# Altium project Assem_Stn_2_Rev1.PrjPcb (part 2 of 3)

## Sheet Thermistor_ADC.SchDoc
size OrCAD B; SheetNumber: 7; SheetTotal: 11
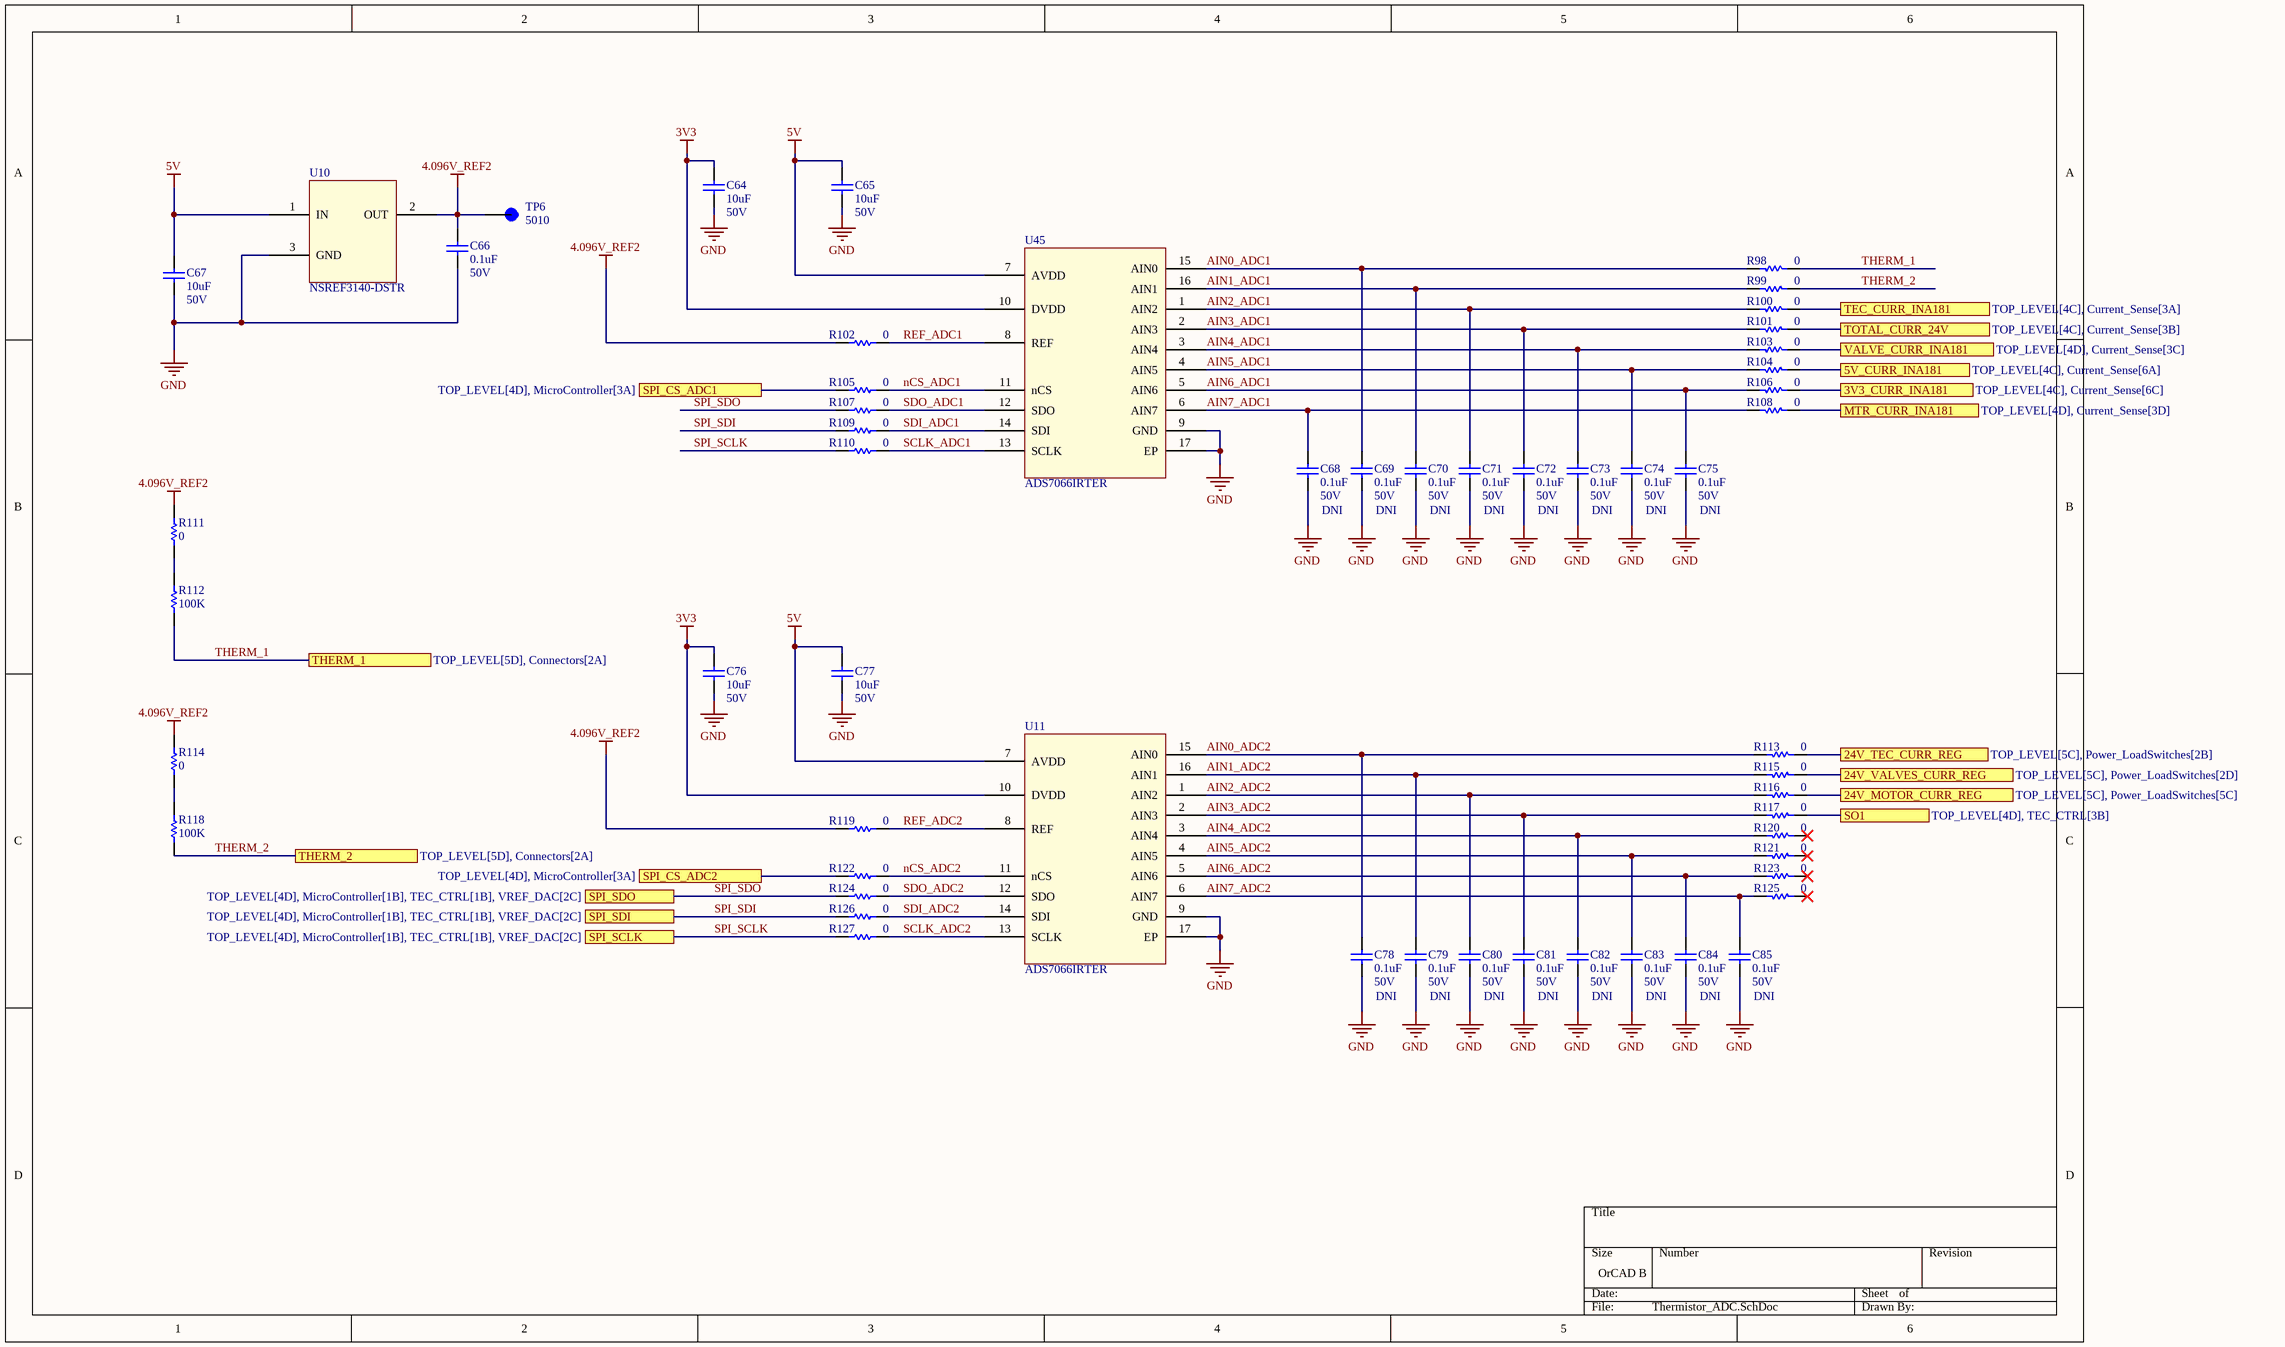
[diagram p5: Thermistor_ADC.SchDoc]

### Parts
C64  value 10uF  Rating: 50V  [DEFAULT_CAPACITOR_0805]  (hidden comment: GRM21BR61H106KE43L)
C65  value 10uF  Rating: 50V  [DEFAULT_CAPACITOR_0805]  (hidden comment: GRM21BR61H106KE43L)
C66  value 0.1uF  Rating: 50V  [DEFAULT_CAPACITOR_0805]  (hidden comment: KGM21NR71H104KT)
C67  value 10uF  Rating: 50V  [DEFAULT_CAPACITOR_0805]  (hidden comment: GRM21BR61H106KE43L)
C68  DNI  value 0.1uF  Rating: 50V  [DEFAULT_CAPACITOR_0805]
C69  DNI  value 0.1uF  Rating: 50V  [DEFAULT_CAPACITOR_0805]
C70  DNI  value 0.1uF  Rating: 50V  [DEFAULT_CAPACITOR_0805]
C71  DNI  value 0.1uF  Rating: 50V  [DEFAULT_CAPACITOR_0805]
C72  DNI  value 0.1uF  Rating: 50V  [DEFAULT_CAPACITOR_0805]
C73  DNI  value 0.1uF  Rating: 50V  [DEFAULT_CAPACITOR_0805]
C74  DNI  value 0.1uF  Rating: 50V  [DEFAULT_CAPACITOR_0805]
C75  DNI  value 0.1uF  Rating: 50V  [DEFAULT_CAPACITOR_0805]
C76  value 10uF  Rating: 50V  [DEFAULT_CAPACITOR_0805]  (hidden comment: GRM21BR61H106KE43L)
C77  value 10uF  Rating: 50V  [DEFAULT_CAPACITOR_0805]  (hidden comment: GRM21BR61H106KE43L)
C78  DNI  value 0.1uF  Rating: 50V  [DEFAULT_CAPACITOR_0805]
C79  DNI  value 0.1uF  Rating: 50V  [DEFAULT_CAPACITOR_0805]
C80  DNI  value 0.1uF  Rating: 50V  [DEFAULT_CAPACITOR_0805]
C81  DNI  value 0.1uF  Rating: 50V  [DEFAULT_CAPACITOR_0805]
C82  DNI  value 0.1uF  Rating: 50V  [DEFAULT_CAPACITOR_0805]
C83  DNI  value 0.1uF  Rating: 50V  [DEFAULT_CAPACITOR_0805]
C84  DNI  value 0.1uF  Rating: 50V  [DEFAULT_CAPACITOR_0805]
C85  DNI  value 0.1uF  Rating: 50V  [DEFAULT_CAPACITOR_0805]
R98  value 0  [DEFAULT_RESISTOR_0805]  (hidden comment: RC0805JR-070RL)
R99  value 0  [DEFAULT_RESISTOR_0805]  (hidden comment: RC0805JR-070RL)
R100  value 0  [DEFAULT_RESISTOR_0805]  (hidden comment: RC0805JR-070RL)
R101  value 0  [DEFAULT_RESISTOR_0805]  (hidden comment: RC0805JR-070RL)
R102  value 0  [DEFAULT_RESISTOR_0805]  (hidden comment: RC0805JR-070RL)
R103  value 0  [DEFAULT_RESISTOR_0805]  (hidden comment: RC0805JR-070RL)
R104  value 0  [DEFAULT_RESISTOR_0805]  (hidden comment: RC0805JR-070RL)
R105  value 0  [DEFAULT_RESISTOR_0805]  (hidden comment: RC0805JR-070RL)
R106  value 0  [DEFAULT_RESISTOR_0805]  (hidden comment: RC0805JR-070RL)
R107  value 0  [DEFAULT_RESISTOR_0805]  (hidden comment: RC0805JR-070RL)
R108  value 0  [DEFAULT_RESISTOR_0805]  (hidden comment: RC0805JR-070RL)
R109  value 0  [DEFAULT_RESISTOR_0805]  (hidden comment: RC0805JR-070RL)
R110  value 0  [DEFAULT_RESISTOR_0805]  (hidden comment: RC0805JR-070RL)
R111  value 0  [DEFAULT_RESISTOR_0805]  (hidden comment: RC0805JR-070RL)
R112  value 100K  [DEFAULT_RESISTOR_0805]  (hidden comment: RG2012P-104-B-T5)
R113  value 0  [DEFAULT_RESISTOR_0805]  (hidden comment: RC0805JR-070RL)
R114  value 0  [DEFAULT_RESISTOR_0805]  (hidden comment: RC0805JR-070RL)
R115  value 0  [DEFAULT_RESISTOR_0805]  (hidden comment: RC0805JR-070RL)
R116  value 0  [DEFAULT_RESISTOR_0805]  (hidden comment: RC0805JR-070RL)
R117  value 0  [DEFAULT_RESISTOR_0805]  (hidden comment: RC0805JR-070RL)
R118  value 100K  [DEFAULT_RESISTOR_0805]  (hidden comment: RG2012P-104-B-T5)
R119  value 0  [DEFAULT_RESISTOR_0805]  (hidden comment: RC0805JR-070RL)
R120  value 0  [DEFAULT_RESISTOR_0805]  (hidden comment: RC0805JR-070RL)
R121  value 0  [DEFAULT_RESISTOR_0805]  (hidden comment: RC0805JR-070RL)
R122  value 0  [DEFAULT_RESISTOR_0805]  (hidden comment: RC0805JR-070RL)
R123  value 0  [DEFAULT_RESISTOR_0805]  (hidden comment: RC0805JR-070RL)
R124  value 0  [DEFAULT_RESISTOR_0805]  (hidden comment: RC0805JR-070RL)
R125  value 0  [DEFAULT_RESISTOR_0805]  (hidden comment: RC0805JR-070RL)
R126  value 0  [DEFAULT_RESISTOR_0805]  (hidden comment: RC0805JR-070RL)
R127  value 0  [DEFAULT_RESISTOR_0805]  (hidden comment: RC0805JR-070RL)
TP6  5010  [TP_5011]
U10  NSREF3140-DSTR  [NSREF3140DSTR-SOT23-3L]
U11  ADS7066IRTER  [ADS7066IRTER-WQFN16]
U45  ADS7066IRTER  [ADS7066IRTER-WQFN16]

### Ports
3V3_CURR_INA181 (see TOP_LEVEL[4C], Current_Sense[6C]), 5V_CURR_INA181 (see TOP_LEVEL[4C], Current_Sense[6A]), 24V_MOTOR_CURR_REG (see TOP_LEVEL[5C], Power_LoadSwitches[5C]), 24V_TEC_CURR_REG (see TOP_LEVEL[5C], Power_LoadSwitches[2B]), 24V_VALVES_CURR_REG (see TOP_LEVEL[5C], Power_LoadSwitches[2D]), MTR_CURR_INA181 (see TOP_LEVEL[4D], Current_Sense[3D]), SO1 (see TOP_LEVEL[4D], TEC_CTRL[3B]), SPI_CS_ADC1 (see TOP_LEVEL[4D], MicroController[3A]), SPI_CS_ADC2 (see TOP_LEVEL[4D], MicroController[3A]), SPI_SCLK (see TOP_LEVEL[4D], MicroController[1B], TEC_CTRL[1B], VREF_DAC[2C]), SPI_SDI (see TOP_LEVEL[4D], MicroController[1B], TEC_CTRL[1B], VREF_DAC[2C]), SPI_SDO (see TOP_LEVEL[4D], MicroController[1B], TEC_CTRL[1B], VREF_DAC[2C]), TEC_CURR_INA181 (see TOP_LEVEL[4C], Current_Sense[3A]), THERM_1 (see TOP_LEVEL[5D], Connectors[2A]), THERM_2 (see TOP_LEVEL[5D], Connectors[2A]), TOTAL_CURR_24V (see TOP_LEVEL[4C], Current_Sense[3B]), VALVE_CURR_INA181 (see TOP_LEVEL[4D], Current_Sense[3C])

### Nets
3V3: C64.2 C76.2 U11.10(DVDD) U45.10(DVDD)
4.096V_REF2: C66.2 R102.2 R111.1 R114.1 R119.2 TP6.TP U10.2(OUT)
5V: C65.2 C67.2 C77.2 U10.1(IN) U11.7(AVDD) U45.7(AVDD)
GND: C64.1 C65.1 C66.1 C67.1 C68.1 C69.1 C70.1 C71.1 C72.1 C73.1 C74.1 C75.1 C76.1 C77.1 C78.1 C79.1 C80.1 C81.1 C82.1 C83.1 C84.1 C85.1 U10.3(GND) U11.9(GND) U11.17(EP) U45.9(GND) U45.17(EP)
3V3_CURR_INA181: R106.2 ; port 3V3_CURR_INA181
5V_CURR_INA181: R104.2 ; port 5V_CURR_INA181
24V_MOTOR_CURR_REG: R116.2 ; port 24V_MOTOR_CURR_REG
24V_TEC_CURR_REG: R113.2 ; port 24V_TEC_CURR_REG
24V_VALVES_CURR_REG: R115.2 ; port 24V_VALVES_CURR_REG
AIN0_ADC1: C69.2 R98.1 U45.15(AIN0)
AIN0_ADC2: C78.2 R113.1 U11.15(AIN0)
AIN1_ADC1: C70.2 R99.1 U45.16(AIN1)
AIN1_ADC2: C79.2 R115.1 U11.16(AIN1)
AIN2_ADC1: C71.2 R100.1 U45.1(AIN2)
AIN2_ADC2: C80.2 R116.1 U11.1(AIN2)
AIN3_ADC1: C72.2 R101.1 U45.2(AIN3)
AIN3_ADC2: C81.2 R117.1 U11.2(AIN3)
AIN4_ADC1: C73.2 R103.1 U45.3(AIN4)
AIN4_ADC2: C82.2 R120.1 U11.3(AIN4)
AIN5_ADC1: C74.2 R104.1 U45.4(AIN5)
AIN5_ADC2: C83.2 R121.1 U11.4(AIN5)
AIN6_ADC1: C75.2 R106.1 U45.5(AIN6)
AIN6_ADC2: C84.2 R123.1 U11.5(AIN6)
AIN7_ADC1: C68.2 R108.1 U45.6(AIN7)
AIN7_ADC2: C85.2 R125.1 U11.6(AIN7)
MTR_CURR_INA181: R108.2 ; port MTR_CURR_INA181
nCS_ADC1: R105.1 U45.11(nCS)
nCS_ADC2: R122.1 U11.11(nCS)
REF_ADC1: R102.1 U45.8(REF)
REF_ADC2: R119.1 U11.8(REF)
SCLK_ADC1: R110.1 U45.13(SCLK)
SCLK_ADC2: R127.1 U11.13(SCLK)
SDI_ADC1: R109.1 U45.14(SDI)
SDI_ADC2: R126.1 U11.14(SDI)
SDO_ADC1: R107.1 U45.12(SDO)
SDO_ADC2: R124.1 U11.12(SDO)
SO1: R117.2 ; port SO1
SPI_CS_ADC1: R105.2 ; port SPI_CS_ADC1
SPI_CS_ADC2: R122.2 ; port SPI_CS_ADC2
SPI_SCLK: R110.2 R127.2 ; port SPI_SCLK
SPI_SDI: R109.2 R126.2 ; port SPI_SDI
SPI_SDO: R107.2 R124.2 ; port SPI_SDO
TEC_CURR_INA181: R100.2 ; port TEC_CURR_INA181
THERM_1: R98.2 R112.2 ; port THERM_1
THERM_2: R99.2 R118.2 ; port THERM_2
TOTAL_CURR_24V: R101.2 ; port TOTAL_CURR_24V
VALVE_CURR_INA181: R103.2 ; port VALVE_CURR_INA181
NetR111_2: R111.2 R112.1
NetR114_2: R114.2 R118.1

Not connected (* = marked no-connect by the designer): R120 2*; R121 2*; R123 2*; R125 2*

### Library data of the parts
C64 C65 C67 C76 C77 = GRM21BR61H106KE43L: CAP CER 10UF 50V X5R 0805; MFR PN: GRM21BR61H106KE43L
C66 C68-C75 C78-C85 = KGM21NR71H104KT: as C2 on sheet Motor and Encoder; MFR PN: KGM21NR71H104KT
R98-R111 R113-R117 R119-R127 = RC0805JR-070RL: RES 0 OHM JUMPER 1/8W 0805; Power: 1/8W; MFR PN: RC0805JR-070RL; Tolerance: *
R112 R118 = RG2012P-104-B-T5: RES SMD 100K OHM 0.1% 1/8W 0805; Power: 1/8W; MFR PN: RG2012P-104-B-T5; Tolerance: 0.1%
TP6 = 5010: PC TEST POINT MULTIPURPOSE RED; MFR PN: 5010
U10 = NSREF3140-DSTR: 0.2% ACCURACY 15PPM 4V REF; Manufacturer: NOVOSENSE; Manufacturer P/N: NSREF3140-DSTR; MFR PN: NSREF3140-DSTR
U11 U45 = ADS7066IRTER: 16 Bit Analog to Digital Converter 8 Input 1 SAR 16-WQFN (3x3); Manufacturer: Texas Instruments; Manufacturer P/N: ADS7066IRTER; MFR PN: ADS7066IRTER

## Sheet VREF_DAC.SchDoc
size OrCAD B; SheetNumber: 8; SheetTotal: 11
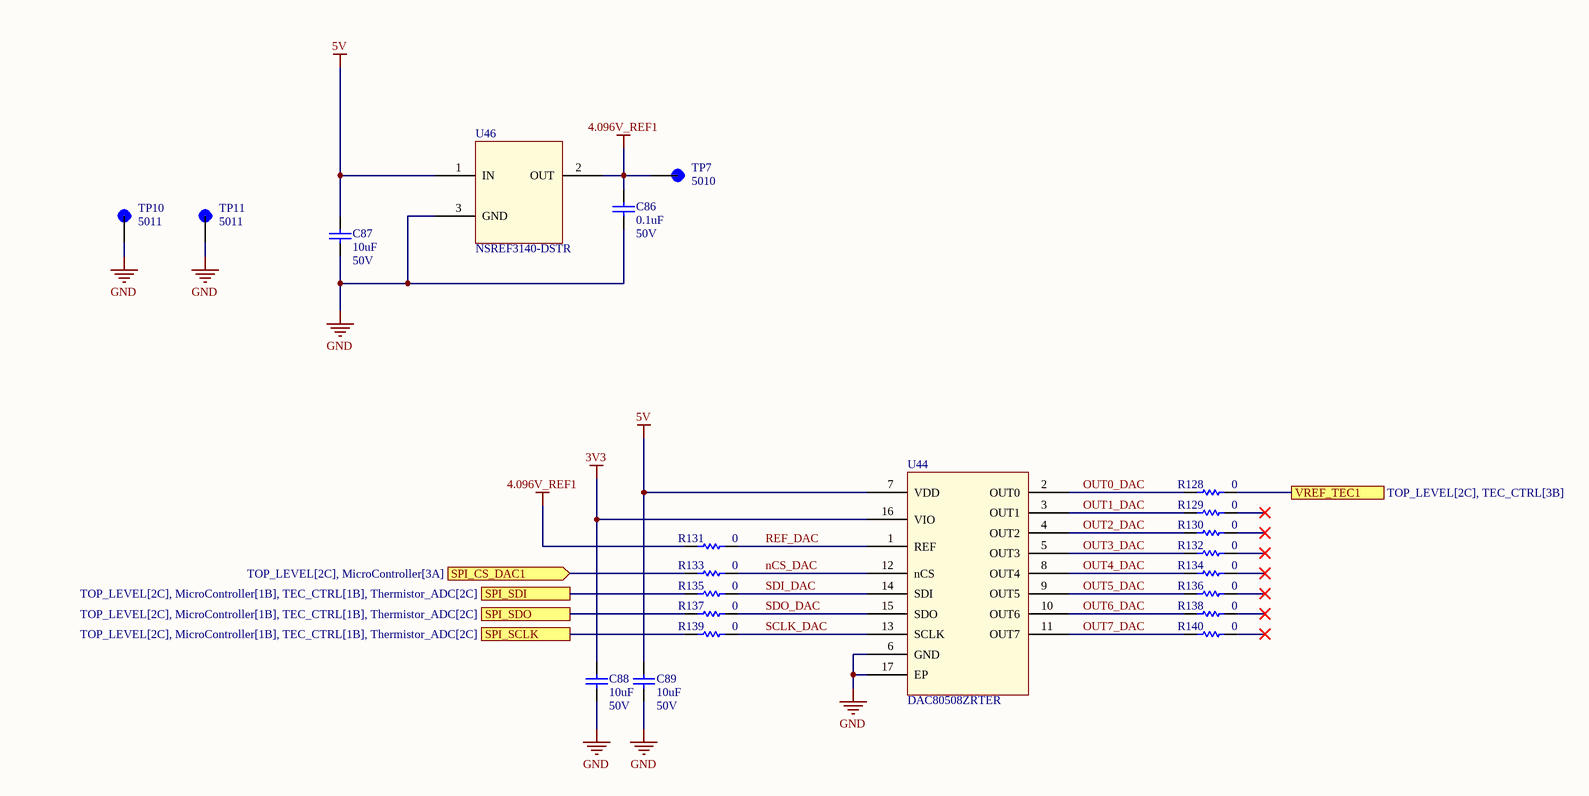
[diagram p6: VREF_DAC.SchDoc]

### Parts
C86  value 0.1uF  Rating: 50V  [DEFAULT_CAPACITOR_0805]  (hidden comment: KGM21NR71H104KT)
C87  value 10uF  Rating: 50V  [DEFAULT_CAPACITOR_0805]  (hidden comment: GRM21BR61H106KE43L)
C88  value 10uF  Rating: 50V  [DEFAULT_CAPACITOR_0805]  (hidden comment: GRM21BR61H106KE43L)
C89  value 10uF  Rating: 50V  [DEFAULT_CAPACITOR_0805]  (hidden comment: GRM21BR61H106KE43L)
R128  value 0  [DEFAULT_RESISTOR_0805]  (hidden comment: RC0805JR-070RL)
R129  value 0  [DEFAULT_RESISTOR_0805]  (hidden comment: RC0805JR-070RL)
R130  value 0  [DEFAULT_RESISTOR_0805]  (hidden comment: RC0805JR-070RL)
R131  value 0  [DEFAULT_RESISTOR_0805]  (hidden comment: RC0805JR-070RL)
R132  value 0  [DEFAULT_RESISTOR_0805]  (hidden comment: RC0805JR-070RL)
R133  value 0  [DEFAULT_RESISTOR_0805]  (hidden comment: RC0805JR-070RL)
R134  value 0  [DEFAULT_RESISTOR_0805]  (hidden comment: RC0805JR-070RL)
R135  value 0  [DEFAULT_RESISTOR_0805]  (hidden comment: RC0805JR-070RL)
R136  value 0  [DEFAULT_RESISTOR_0805]  (hidden comment: RC0805JR-070RL)
R137  value 0  [DEFAULT_RESISTOR_0805]  (hidden comment: RC0805JR-070RL)
R138  value 0  [DEFAULT_RESISTOR_0805]  (hidden comment: RC0805JR-070RL)
R139  value 0  [DEFAULT_RESISTOR_0805]  (hidden comment: RC0805JR-070RL)
R140  value 0  [DEFAULT_RESISTOR_0805]  (hidden comment: RC0805JR-070RL)
TP7  5010  [TP_5011]
TP10  5011  [TP_5011]
TP11  5011  [TP_5011]
U44  DAC80508ZRTER  [DAC80508ZRTER-WQFN16]
U46  NSREF3140-DSTR  [NSREF3140DSTR-SOT23-3L]

### Ports
SPI_CS_DAC1 (in, see TOP_LEVEL[2C], MicroController[3A]), SPI_SCLK (see TOP_LEVEL[2C], MicroController[1B], TEC_CTRL[1B], Thermistor_ADC[2C]), SPI_SDI (see TOP_LEVEL[2C], MicroController[1B], TEC_CTRL[1B], Thermistor_ADC[2C]), SPI_SDO (see TOP_LEVEL[2C], MicroController[1B], TEC_CTRL[1B], Thermistor_ADC[2C]), VREF_TEC1 (see TOP_LEVEL[2C], TEC_CTRL[3B])

### Nets
3V3: C88.2 U44.16(VIO)
4.096V_REF1: C86.2 R131.2 TP7.TP U46.2(OUT)
5V: C87.2 C89.2 U44.7(VDD) U46.1(IN)
GND: C86.1 C87.1 C88.1 C89.1 TP10.TP TP11.TP U44.6(GND) U44.17(EP) U46.3(GND)
nCS_DAC: R133.1 U44.12(nCS)
OUT0_DAC: R128.2 U44.2(OUT0)
OUT1_DAC: R129.2 U44.3(OUT1)
OUT2_DAC: R130.2 U44.4(OUT2)
OUT3_DAC: R132.2 U44.5(OUT3)
OUT4_DAC: R134.2 U44.8(OUT4)
OUT5_DAC: R136.2 U44.9(OUT5)
OUT6_DAC: R138.2 U44.10(OUT6)
OUT7_DAC: R140.2 U44.11(OUT7)
REF_DAC: R131.1 U44.1(REF)
SCLK_DAC: R139.1 U44.13(SCLK)
SDI_DAC: R135.1 U44.14(SDI)
SDO_DAC: R137.1 U44.15(SDO)
SPI_CS_DAC1: R133.2 ; port SPI_CS_DAC1
SPI_SCLK: R139.2 ; port SPI_SCLK
SPI_SDI: R135.2 ; port SPI_SDI
SPI_SDO: R137.2 ; port SPI_SDO
VREF_TEC1: R128.1 ; port VREF_TEC1

Not connected (* = marked no-connect by the designer): R129 1*; R130 1*; R132 1*; R134 1*; R136 1*; R138 1*; R140 1*

### Library data of the parts
C86 = KGM21NR71H104KT: CAP CER 0.1UF 50V X7R 0805; Manufacturer: Cal-Chip Electronics, Inc.; Manufacturer P/N: GMC55X7R226M50NT; MFR PN: KGM21NR71H104KT
C87-C89 = GRM21BR61H106KE43L: CAP CER 10UF 50V X5R 0805; MFR PN: GRM21BR61H106KE43L
R128-R140 = RC0805JR-070RL: RES 0 OHM JUMPER 1/8W 0805; Power: 1/8W; MFR PN: RC0805JR-070RL; Tolerance: *
TP7 = 5010: PC TEST POINT MULTIPURPOSE RED; MFR PN: 5010
TP10 TP11 = 5011: PC TEST POINT MULTIPURPOSE BLACK; MF: Keystone Electronics Corp.; SnapEDA_Link: https://www.snapeda.com/parts/5011/Keystone/view-part/?ref=snap; Package: None; Value: *; MP: 5011; Check_prices: https://www.snapeda.com/parts/5011/Keystone/view-part/?ref=eda; MFR PN: 5011
U44 = DAC80508ZRTER: IC DAC 16BIT V-OUT 16WQFN; Manufacturer: Texas Instruments; Manufacturer P/N: DAC80508ZRTER; MFR PN: DAC80508ZRTER
U46 = NSREF3140-DSTR: 0.2% ACCURACY 15PPM 4V REF; Manufacturer: NOVOSENSE; Manufacturer P/N: NSREF3140-DSTR; MFR PN: NSREF3140-DSTR

## Sheet Current_Sense.SchDoc
size OrCAD B; SheetNumber: 9; SheetTotal: 11
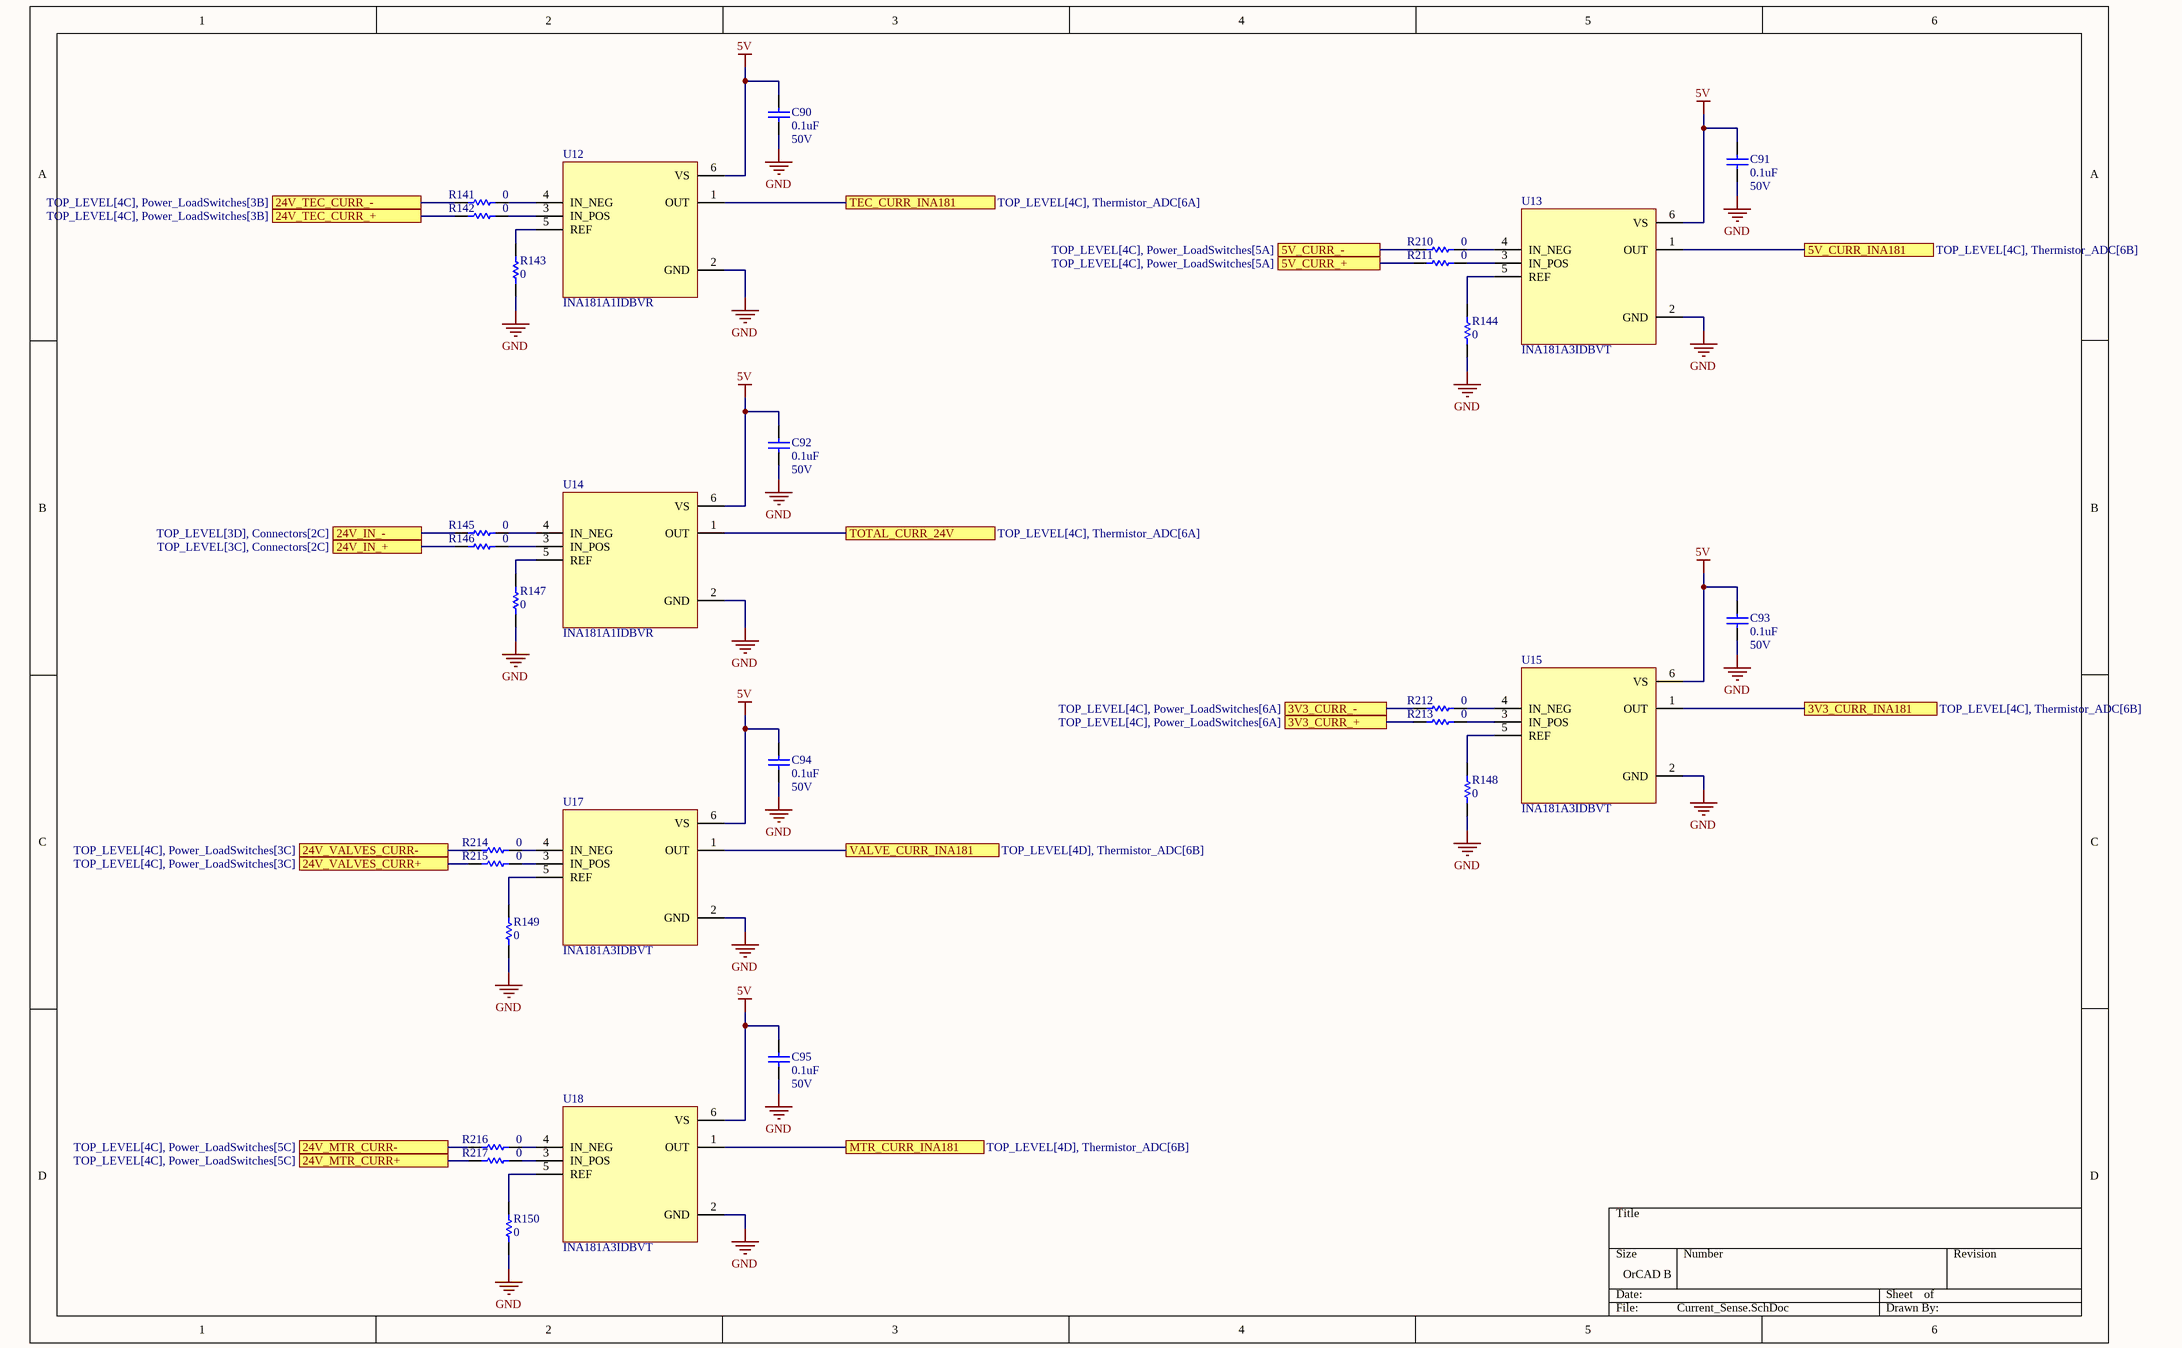
[diagram p7: Current_Sense.SchDoc]

### Parts
C90  value 0.1uF  Rating: 50V  [DEFAULT_CAPACITOR_0805]  (hidden comment: KGM21NR71H104KT)
C91  value 0.1uF  Rating: 50V  [DEFAULT_CAPACITOR_0805]  (hidden comment: KGM21NR71H104KT)
C92  value 0.1uF  Rating: 50V  [DEFAULT_CAPACITOR_0805]  (hidden comment: KGM21NR71H104KT)
C93  value 0.1uF  Rating: 50V  [DEFAULT_CAPACITOR_0805]  (hidden comment: KGM21NR71H104KT)
C94  value 0.1uF  Rating: 50V  [DEFAULT_CAPACITOR_0805]  (hidden comment: KGM21NR71H104KT)
C95  value 0.1uF  Rating: 50V  [DEFAULT_CAPACITOR_0805]  (hidden comment: KGM21NR71H104KT)
R141  value 0  [DEFAULT_RESISTOR_0805]  (hidden comment: RC0805JR-070RL)
R142  value 0  [DEFAULT_RESISTOR_0805]  (hidden comment: RC0805JR-070RL)
R143  value 0  [DEFAULT_RESISTOR_0805]  (hidden comment: RC0805JR-070RL)
R144  value 0  [DEFAULT_RESISTOR_0805]  (hidden comment: RC0805JR-070RL)
R145  value 0  [DEFAULT_RESISTOR_0805]  (hidden comment: RC0805JR-070RL)
R146  value 0  [DEFAULT_RESISTOR_0805]  (hidden comment: RC0805JR-070RL)
R147  value 0  [DEFAULT_RESISTOR_0805]  (hidden comment: RC0805JR-070RL)
R148  value 0  [DEFAULT_RESISTOR_0805]  (hidden comment: RC0805JR-070RL)
R149  value 0  [DEFAULT_RESISTOR_0805]  (hidden comment: RC0805JR-070RL)
R150  value 0  [DEFAULT_RESISTOR_0805]  (hidden comment: RC0805JR-070RL)
R210  value 0  [DEFAULT_RESISTOR_0805]  (hidden comment: RC0805JR-070RL)
R211  value 0  [DEFAULT_RESISTOR_0805]  (hidden comment: RC0805JR-070RL)
R212  value 0  [DEFAULT_RESISTOR_0805]  (hidden comment: RC0805JR-070RL)
R213  value 0  [DEFAULT_RESISTOR_0805]  (hidden comment: RC0805JR-070RL)
R214  value 0  [DEFAULT_RESISTOR_0805]  (hidden comment: RC0805JR-070RL)
R215  value 0  [DEFAULT_RESISTOR_0805]  (hidden comment: RC0805JR-070RL)
R216  value 0  [DEFAULT_RESISTOR_0805]  (hidden comment: RC0805JR-070RL)
R217  value 0  [DEFAULT_RESISTOR_0805]  (hidden comment: RC0805JR-070RL)
U12  INA181A1IDBVR  [INA181A1IDBVR]
U13  INA181A3IDBVT  [INA181A1IDBVR]
U14  INA181A1IDBVR  [INA181A1IDBVR]
U15  INA181A3IDBVT  [INA181A1IDBVR]
U17  INA181A3IDBVT  [INA181A1IDBVR]
U18  INA181A3IDBVT  [INA181A1IDBVR]

### Ports
3V3_CURR_+ (see TOP_LEVEL[4C], Power_LoadSwitches[6A]), 3V3_CURR_- (see TOP_LEVEL[4C], Power_LoadSwitches[6A]), 3V3_CURR_INA181 (see TOP_LEVEL[4C], Thermistor_ADC[6B]), 5V_CURR_+ (see TOP_LEVEL[4C], Power_LoadSwitches[5A]), 5V_CURR_- (see TOP_LEVEL[4C], Power_LoadSwitches[5A]), 5V_CURR_INA181 (see TOP_LEVEL[4C], Thermistor_ADC[6B]), 24V_IN_+ (see TOP_LEVEL[3C], Connectors[2C]), 24V_IN_- (see TOP_LEVEL[3D], Connectors[2C]), 24V_MTR_CURR+ (see TOP_LEVEL[4C], Power_LoadSwitches[5C]), 24V_MTR_CURR- (see TOP_LEVEL[4C], Power_LoadSwitches[5C]), 24V_TEC_CURR_+ (see TOP_LEVEL[4C], Power_LoadSwitches[3B]), 24V_TEC_CURR_- (see TOP_LEVEL[4C], Power_LoadSwitches[3B]), 24V_VALVES_CURR+ (see TOP_LEVEL[4C], Power_LoadSwitches[3C]), 24V_VALVES_CURR- (see TOP_LEVEL[4C], Power_LoadSwitches[3C]), MTR_CURR_INA181 (see TOP_LEVEL[4D], Thermistor_ADC[6B]), TEC_CURR_INA181 (see TOP_LEVEL[4C], Thermistor_ADC[6A]), TOTAL_CURR_24V (see TOP_LEVEL[4C], Thermistor_ADC[6A]), VALVE_CURR_INA181 (see TOP_LEVEL[4D], Thermistor_ADC[6B])

### Nets
5V: C90.2 C91.2 C92.2 C93.2 C94.2 C95.2 U12.6(VS) U13.6(VS) U14.6(VS) U15.6(VS) U17.6(VS) U18.6(VS)
GND: C90.1 C91.1 C92.1 C93.1 C94.1 C95.1 R143.2 R144.2 R147.2 R148.2 R149.2 R150.2 U12.2(GND) U13.2(GND) U14.2(GND) U15.2(GND) U17.2(GND) U18.2(GND)
3V3_CURR_+: R213.2 ; port 3V3_CURR_+
3V3_CURR_-: R212.2 ; port 3V3_CURR_-
3V3_CURR_INA181: U15.1(OUT) ; port 3V3_CURR_INA181
5V_CURR_+: R211.2 ; port 5V_CURR_+
5V_CURR_-: R210.2 ; port 5V_CURR_-
5V_CURR_INA181: U13.1(OUT) ; port 5V_CURR_INA181
24V_IN_+: R146.2 ; port 24V_IN_+
24V_IN_-: R145.2 ; port 24V_IN_-
24V_MTR_CURR+: R217.2 ; port 24V_MTR_CURR+
24V_MTR_CURR-: R216.2 ; port 24V_MTR_CURR-
24V_TEC_CURR_+: R142.2 ; port 24V_TEC_CURR_+
24V_TEC_CURR_-: R141.2 ; port 24V_TEC_CURR_-
24V_VALVES_CURR+: R215.2 ; port 24V_VALVES_CURR+
24V_VALVES_CURR-: R214.2 ; port 24V_VALVES_CURR-
MTR_CURR_INA181: U18.1(OUT) ; port MTR_CURR_INA181
TEC_CURR_INA181: U12.1(OUT) ; port TEC_CURR_INA181
TOTAL_CURR_24V: U14.1(OUT) ; port TOTAL_CURR_24V
VALVE_CURR_INA181: U17.1(OUT) ; port VALVE_CURR_INA181
NetR141_1: R141.1 U12.4(IN_NEG)
NetR142_1: R142.1 U12.3(IN_POS)
NetR143_1: R143.1 U12.5(REF)
NetR144_1: R144.1 U13.5(REF)
NetR145_1: R145.1 U14.4(IN_NEG)
NetR146_1: R146.1 U14.3(IN_POS)
NetR147_1: R147.1 U14.5(REF)
NetR148_1: R148.1 U15.5(REF)
NetR149_1: R149.1 U17.5(REF)
NetR150_1: R150.1 U18.5(REF)
NetR210_1: R210.1 U13.4(IN_NEG)
NetR211_1: R211.1 U13.3(IN_POS)
NetR212_1: R212.1 U15.4(IN_NEG)
NetR213_1: R213.1 U15.3(IN_POS)
NetR214_1: R214.1 U17.4(IN_NEG)
NetR215_1: R215.1 U17.3(IN_POS)
NetR216_1: R216.1 U18.4(IN_NEG)
NetR217_1: R217.1 U18.3(IN_POS)

### Library data of the parts
C90-C95 = KGM21NR71H104KT: as C86 on sheet VREF_DAC; MFR PN: KGM21NR71H104KT
R141-R150 R210-R217 = RC0805JR-070RL: RES 0 OHM JUMPER 1/8W 0805; Power: 1/8W; MFR PN: RC0805JR-070RL; Tolerance: *
U12 U14 = INA181A1IDBVR: IC CURR SENSE 1 CIRCUIT SOT23-6; MF: Texas Instruments; SnapEDA_Link: https://www.snapeda.com/parts/INA181A1IDBVR/Texas+Instruments/view-part/?ref=snap; Package: SOT-23-6 Texas Instruments; Value: *; MP: INA181A1IDBVR; Check_prices: https://www.snapeda.com/parts/INA181A1IDBVR/Texas+Instruments/view-part/?ref=eda; MFR PN: INA181A1IDBVR
U13 U15 U17 U18 = INA181A3IDBVT: IC CURR SENSE 1 CIRCUIT SOT23-6; MF: Texas Instruments; SnapEDA_Link: https://www.snapeda.com/parts/INA181A1IDBVR/Texas+Instruments/view-part/?ref=snap; Package: SOT-23-6 Texas Instruments; Value: *; MP: INA181A1IDBVR; Check_prices: https://www.snapeda.com/parts/INA181A1IDBVR/Texas+Instruments/view-part/?ref=eda; MFR PN: INA181A3IDBVT

## Sheet FTDI_Photosensor.SchDoc
size OrCAD B; SheetNumber: 10; SheetTotal: 11
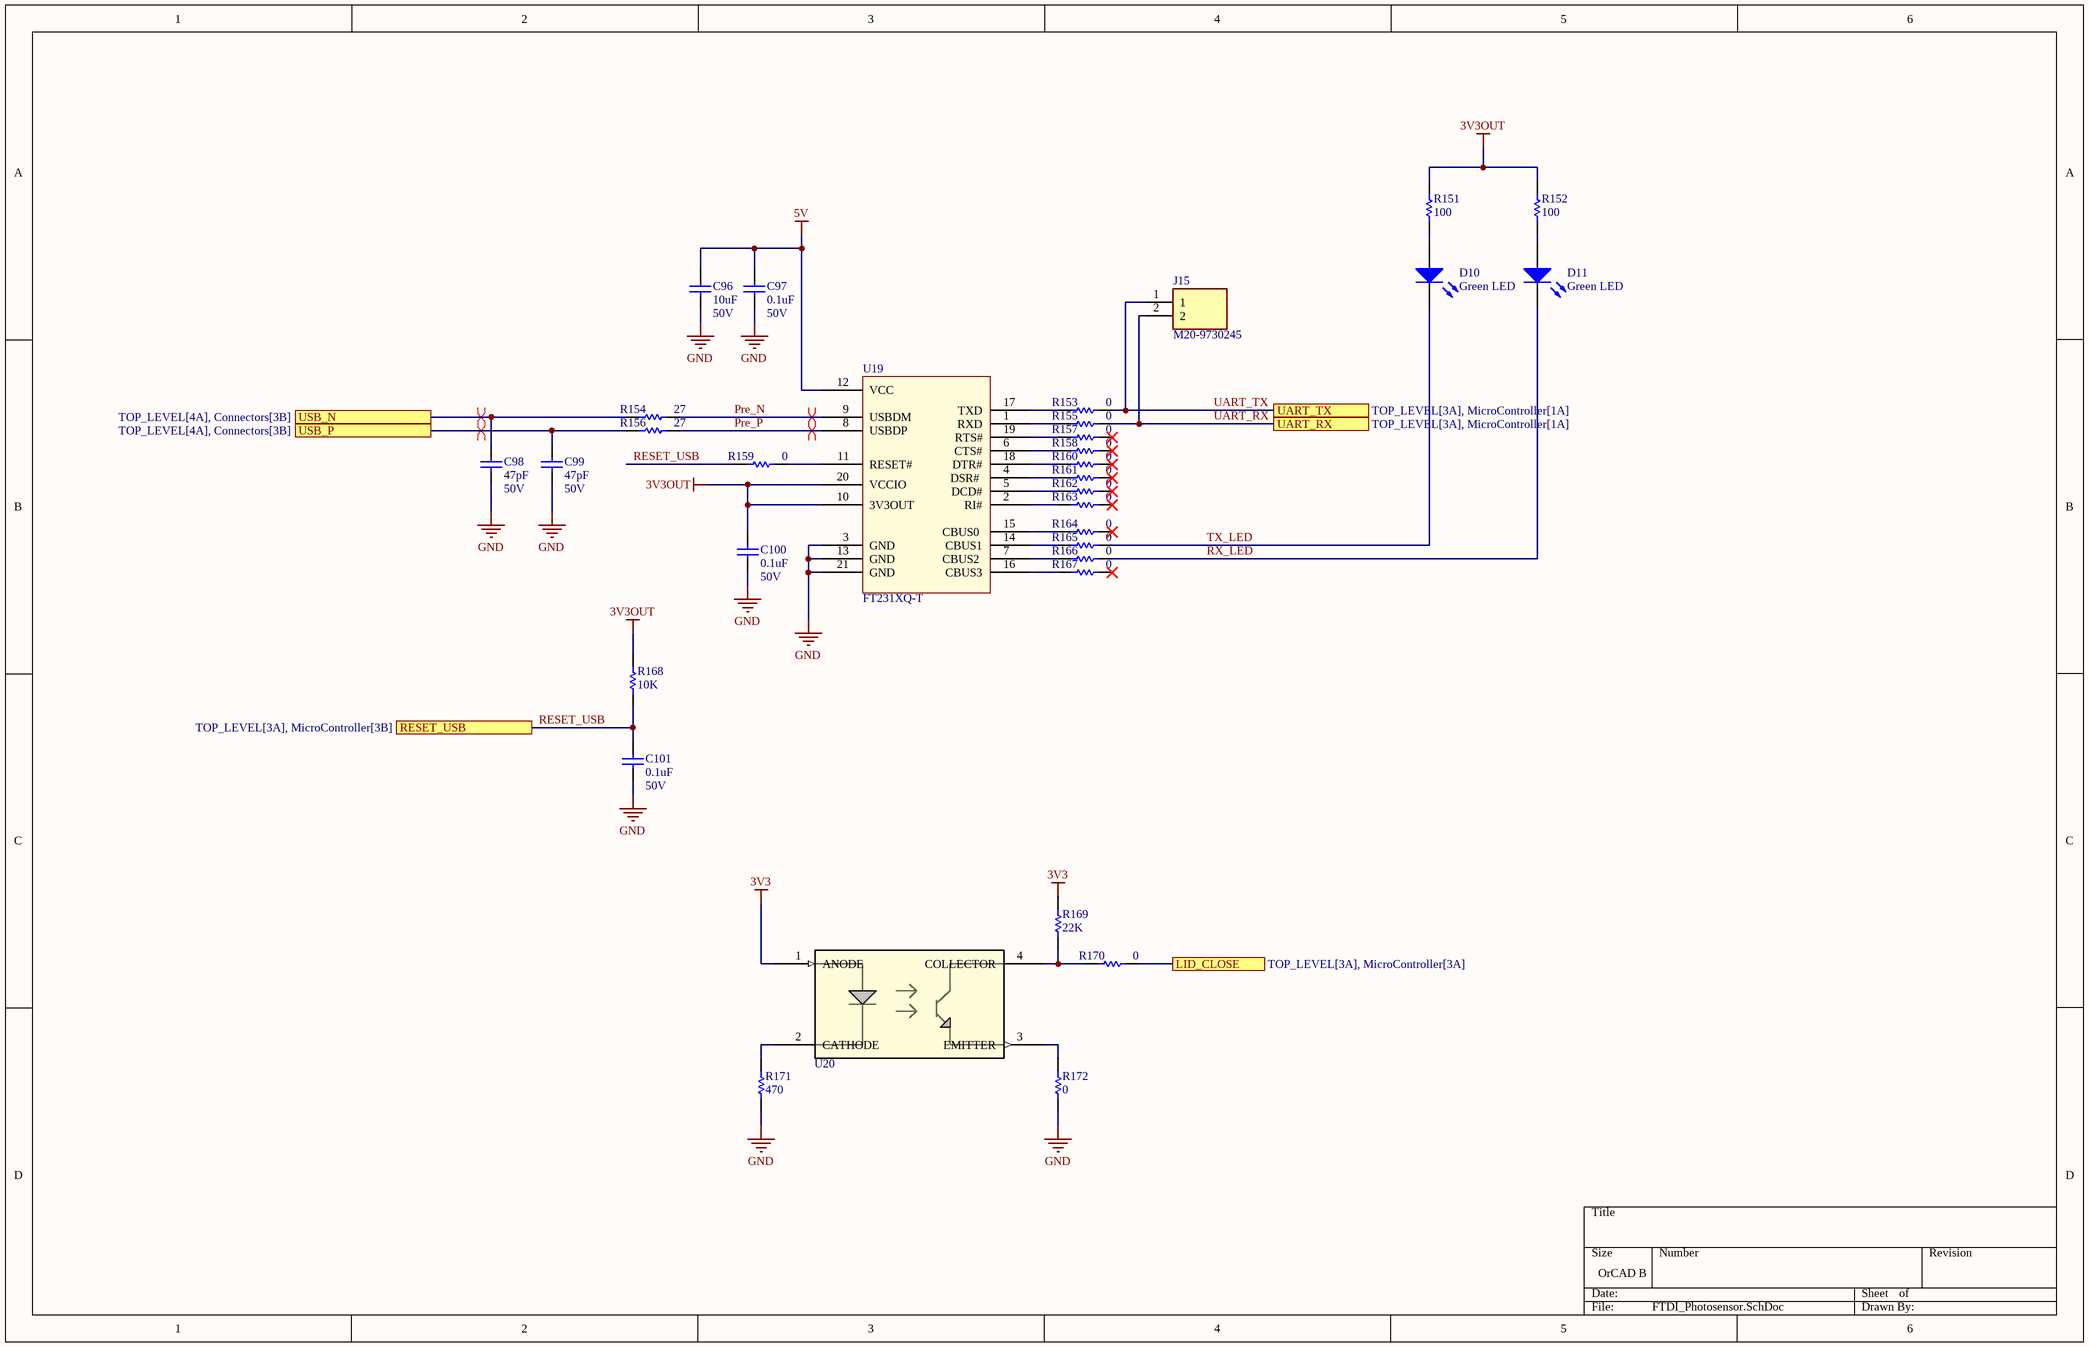
[diagram p8: FTDI_Photosensor.SchDoc]

### Parts
C96  value 10uF  Rating: 50V  [DEFAULT_CAPACITOR_0805]  (hidden comment: GRM21BR61H106KE43L)
C97  value 0.1uF  Rating: 50V  [DEFAULT_CAPACITOR_0805]  (hidden comment: KGM21NR71H104KT)
C98  value 47pF  Rating: 50V  [DEFAULT_CAPACITOR_0805]  (hidden comment: C0805X470J5GACTU)
C99  value 47pF  Rating: 50V  [DEFAULT_CAPACITOR_0805]  (hidden comment: C0805X470J5GACTU)
C100  value 0.1uF  Rating: 50V  [DEFAULT_CAPACITOR_0805]  (hidden comment: KGM21NR71H104KT)
C101  value 0.1uF  Rating: 50V  [DEFAULT_CAPACITOR_0805]  (hidden comment: KGM21NR71H104KT)
D10  value Green LED  [DEFAULT_RESISTOR_0805]  (hidden comment: LSM0805452V)
D11  value Green LED  [DEFAULT_RESISTOR_0805]  (hidden comment: LSM0805452V)
J15  M20-9730245  [M209730245]
R151  value 100  [DEFAULT_RESISTOR_0805]  (hidden comment: CRCW0805100RFKEA)
R152  value 100  [DEFAULT_RESISTOR_0805]  (hidden comment: CRCW0805100RFKEA)
R153  value 0  [DEFAULT_RESISTOR_0805]  (hidden comment: RC0805JR-070RL)
R154  value 27  [DEFAULT_RESISTOR_0805]  (hidden comment: RMCF0805FT27R0)
R155  value 0  [DEFAULT_RESISTOR_0805]  (hidden comment: RC0805JR-070RL)
R156  value 27  [DEFAULT_RESISTOR_0805]  (hidden comment: RMCF0805FT27R0)
R157  value 0  [DEFAULT_RESISTOR_0805]  (hidden comment: RC0805JR-070RL)
R158  value 0  [DEFAULT_RESISTOR_0805]  (hidden comment: RC0805JR-070RL)
R159  value 0  [DEFAULT_RESISTOR_0805]  (hidden comment: RC0805JR-070RL)
R160  value 0  [DEFAULT_RESISTOR_0805]  (hidden comment: RC0805JR-070RL)
R161  value 0  [DEFAULT_RESISTOR_0805]  (hidden comment: RC0805JR-070RL)
R162  value 0  [DEFAULT_RESISTOR_0805]  (hidden comment: RC0805JR-070RL)
R163  value 0  [DEFAULT_RESISTOR_0805]  (hidden comment: RC0805JR-070RL)
R164  value 0  [DEFAULT_RESISTOR_0805]  (hidden comment: RC0805JR-070RL)
R165  value 0  [DEFAULT_RESISTOR_0805]  (hidden comment: RC0805JR-070RL)
R166  value 0  [DEFAULT_RESISTOR_0805]  (hidden comment: RC0805JR-070RL)
R167  value 0  [DEFAULT_RESISTOR_0805]  (hidden comment: RC0805JR-070RL)
R168  value 10K  [DEFAULT_RESISTOR_0805]  (hidden comment: CRCW080510K0FKEA)
R169  value 22K  [DEFAULT_RESISTOR_0805]  (hidden comment: RC0805FR-1322KL)
R170  value 0  [DEFAULT_RESISTOR_0805]  (hidden comment: RC0805JR-070RL)
R171  value 470  [DEFAULT_RESISTOR_0805]  (hidden comment: RC0805FR-07470RL)
R172  value 0  [DEFAULT_RESISTOR_0805]  (hidden comment: RC0805JR-070RL)
U19  FT231XQ-T  [FT231XQ-QFN20]
U20  EE-SX1320  [EE-SX1320_OMR]  (value not drawn)

### Ports
LID_CLOSE (see TOP_LEVEL[3A], MicroController[3A]), RESET_USB (see TOP_LEVEL[3A], MicroController[3B]), UART_RX (see TOP_LEVEL[3A], MicroController[1A]), UART_TX (see TOP_LEVEL[3A], MicroController[1A]), USB_N (see TOP_LEVEL[4A], Connectors[3B]), USB_P (see TOP_LEVEL[4A], Connectors[3B])

### Nets
3V3: R169.1 U20.1(ANODE)
3V3OUT: C100.2 R151.1 R152.1 R168.1 U19.10(3V3OUT) U19.20(VCCIO)
5V: C96.2 C97.2 U19.12(VCC)
GND: C96.1 C97.1 C98.1 C99.1 C100.1 C101.1 R171.2 R172.2 U19.3(GND) U19.13(GND) U19.21(GND)
LID_CLOSE: R170.1 ; port LID_CLOSE
Pre_N: R154.1 U19.9(USBDM)
Pre_P: R156.1 U19.8(USBDP)
RESET_USB: C101.2 R159.2 R168.2 ; port RESET_USB
RX_LED: D11.2(K) R166.1
TX_LED: D10.2(K) R165.1
UART_RX: J15.2 R155.1 ; port UART_RX
UART_TX: J15.1 R153.1 ; port UART_TX
USB_N: C98.2 R154.2 ; port USB_N
USB_P: C99.2 R156.2 ; port USB_P
NetD10_1: D10.1(A) R151.2
NetD11_1: D11.1(A) R152.2
NetR153_2: R153.2 U19.17(TXD)
NetR155_2: R155.2 U19.1(RXD)
NetR157_2: R157.2 U19.19(RTS#)
NetR158_2: R158.2 U19.6(CTS#)
NetR159_1: R159.1 U19.11(RESET#)
NetR160_2: R160.2 U19.18(DTR#)
NetR161_2: R161.2 U19.4(DSR#)
NetR162_2: R162.2 U19.5(DCD#)
NetR163_2: R163.2 U19.2(RI#)
NetR164_2: R164.2 U19.15(CBUS0)
NetR165_2: R165.2 U19.14(CBUS1)
NetR166_2: R166.2 U19.7(CBUS2)
NetR167_2: R167.2 U19.16(CBUS3)
NetR169_2: R169.2 R170.2 U20.4(COLLECTOR)
NetR171_1: R171.1 U20.2(CATHODE)
NetR172_1: R172.1 U20.3(EMITTER)

Not connected (* = marked no-connect by the designer): R157 1*; R158 1*; R160 1*; R161 1*; R162 1*; R163 1*; R164 1*; R167 1*

### Layout directives
differential pair: Pre_N, Pre_P, USB_N, USB_P

### Library data of the parts
C96 = GRM21BR61H106KE43L: CAP CER 10UF 50V X5R 0805; MFR PN: GRM21BR61H106KE43L
C97 C100 C101 = KGM21NR71H104KT: as C86 on sheet VREF_DAC; MFR PN: KGM21NR71H104KT
C98 C99 = C0805X470J5GACTU: CAP CER 47PF 50V C0G/NP0 0805; MFR PN: C0805X470J5GACTU
D10 D11 = LSM0805452V: LED GREEN; MP: Blue LED 0805; MFR PN: LSM0805452V
J15 = M20-9730245: M20: 2 Pos Plug SIL Straight 3mm THT Connector 7mm pin Gold; Manufacturer_Name: Harwin; Geometry.Height: 9.54mm; Manufacturer_Part_Number: M20-9730245; Mouser Part Number: 855-M20-9730245; Mouser Price/Stock: https://www.mouser.co.uk/ProductDetail/Harwin/M20-9730245?qs=%252Bk6%2F5FB6qrkOd7%252Bh6nj7DA%3D%3D; Arrow Part Number: *; Arrow Price/Stock: *; Datasheet Link: https://content.harwin.com/m/d105a7681d963845/original/DRG-00452-Technical-Drawing-Datasheet-M20-973-pdf.pdf; MFR PN: M20-9730245
R151 R152 = CRCW0805100RFKEA: RES SMD 100 OHM 1% 1/4W 0805; Power: 1/4W; MFR PN: CRCW0805100RFKEA; Tolerance: 1%
R153 R155 R157-R167 R170 R172 = RC0805JR-070RL: RES 0 OHM JUMPER 1/8W 0805; Power: 1/8W; MFR PN: RC0805JR-070RL; Tolerance: *
R154 R156 = RMCF0805FT27R0: RES 27 OHM 1% 1/8W 0805; Power: 1/8W; MFR PN: RMCF0805FT27R0; Tolerance: 1%
R168 = CRCW080510K0FKEA: RES SMD 10K OHM 1% 1/4W 0805; Power: 1/4W; MFR PN: CRCW080510K0FKEA; Tolerance: 1%
R169 = RC0805FR-1322KL: RES 22K OHM 1% 1/8W 0805; Power: 1/8W; MFR PN: RC0805FR-1322KL; Tolerance: 1%
R171 = RC0805FR-07470RL: RES 470 OHM 1% 1/8W 0805; Power: 1/8W; MFR PN: RC0805FR-07470RL; Tolerance: 1%
U19 = FT231XQ-T: IC USB SERIAL FULL UART 20QFN; Manufacturer: FTDI; Manufacturer P/N: FT231XQ-T; MFR PN: FT231XQ-T
U20 = EE-SX1320: Optical Sensor Through-Beam 0.079" (2mm) Phototransistor Module, Connector, Slot Type; Manufacturer_Name: Omron; Copyright: Copyright (C) 2026 Ultra Librarian. All rights reserved.; Manufacturer_Part_Number: EE-SX1320; RefDes: RefDes; Type: Type; MFR PN: EE-SX1320

## Sheet MicroController.SchDoc
size OrCAD B; SheetNumber: 11; SheetTotal: 11
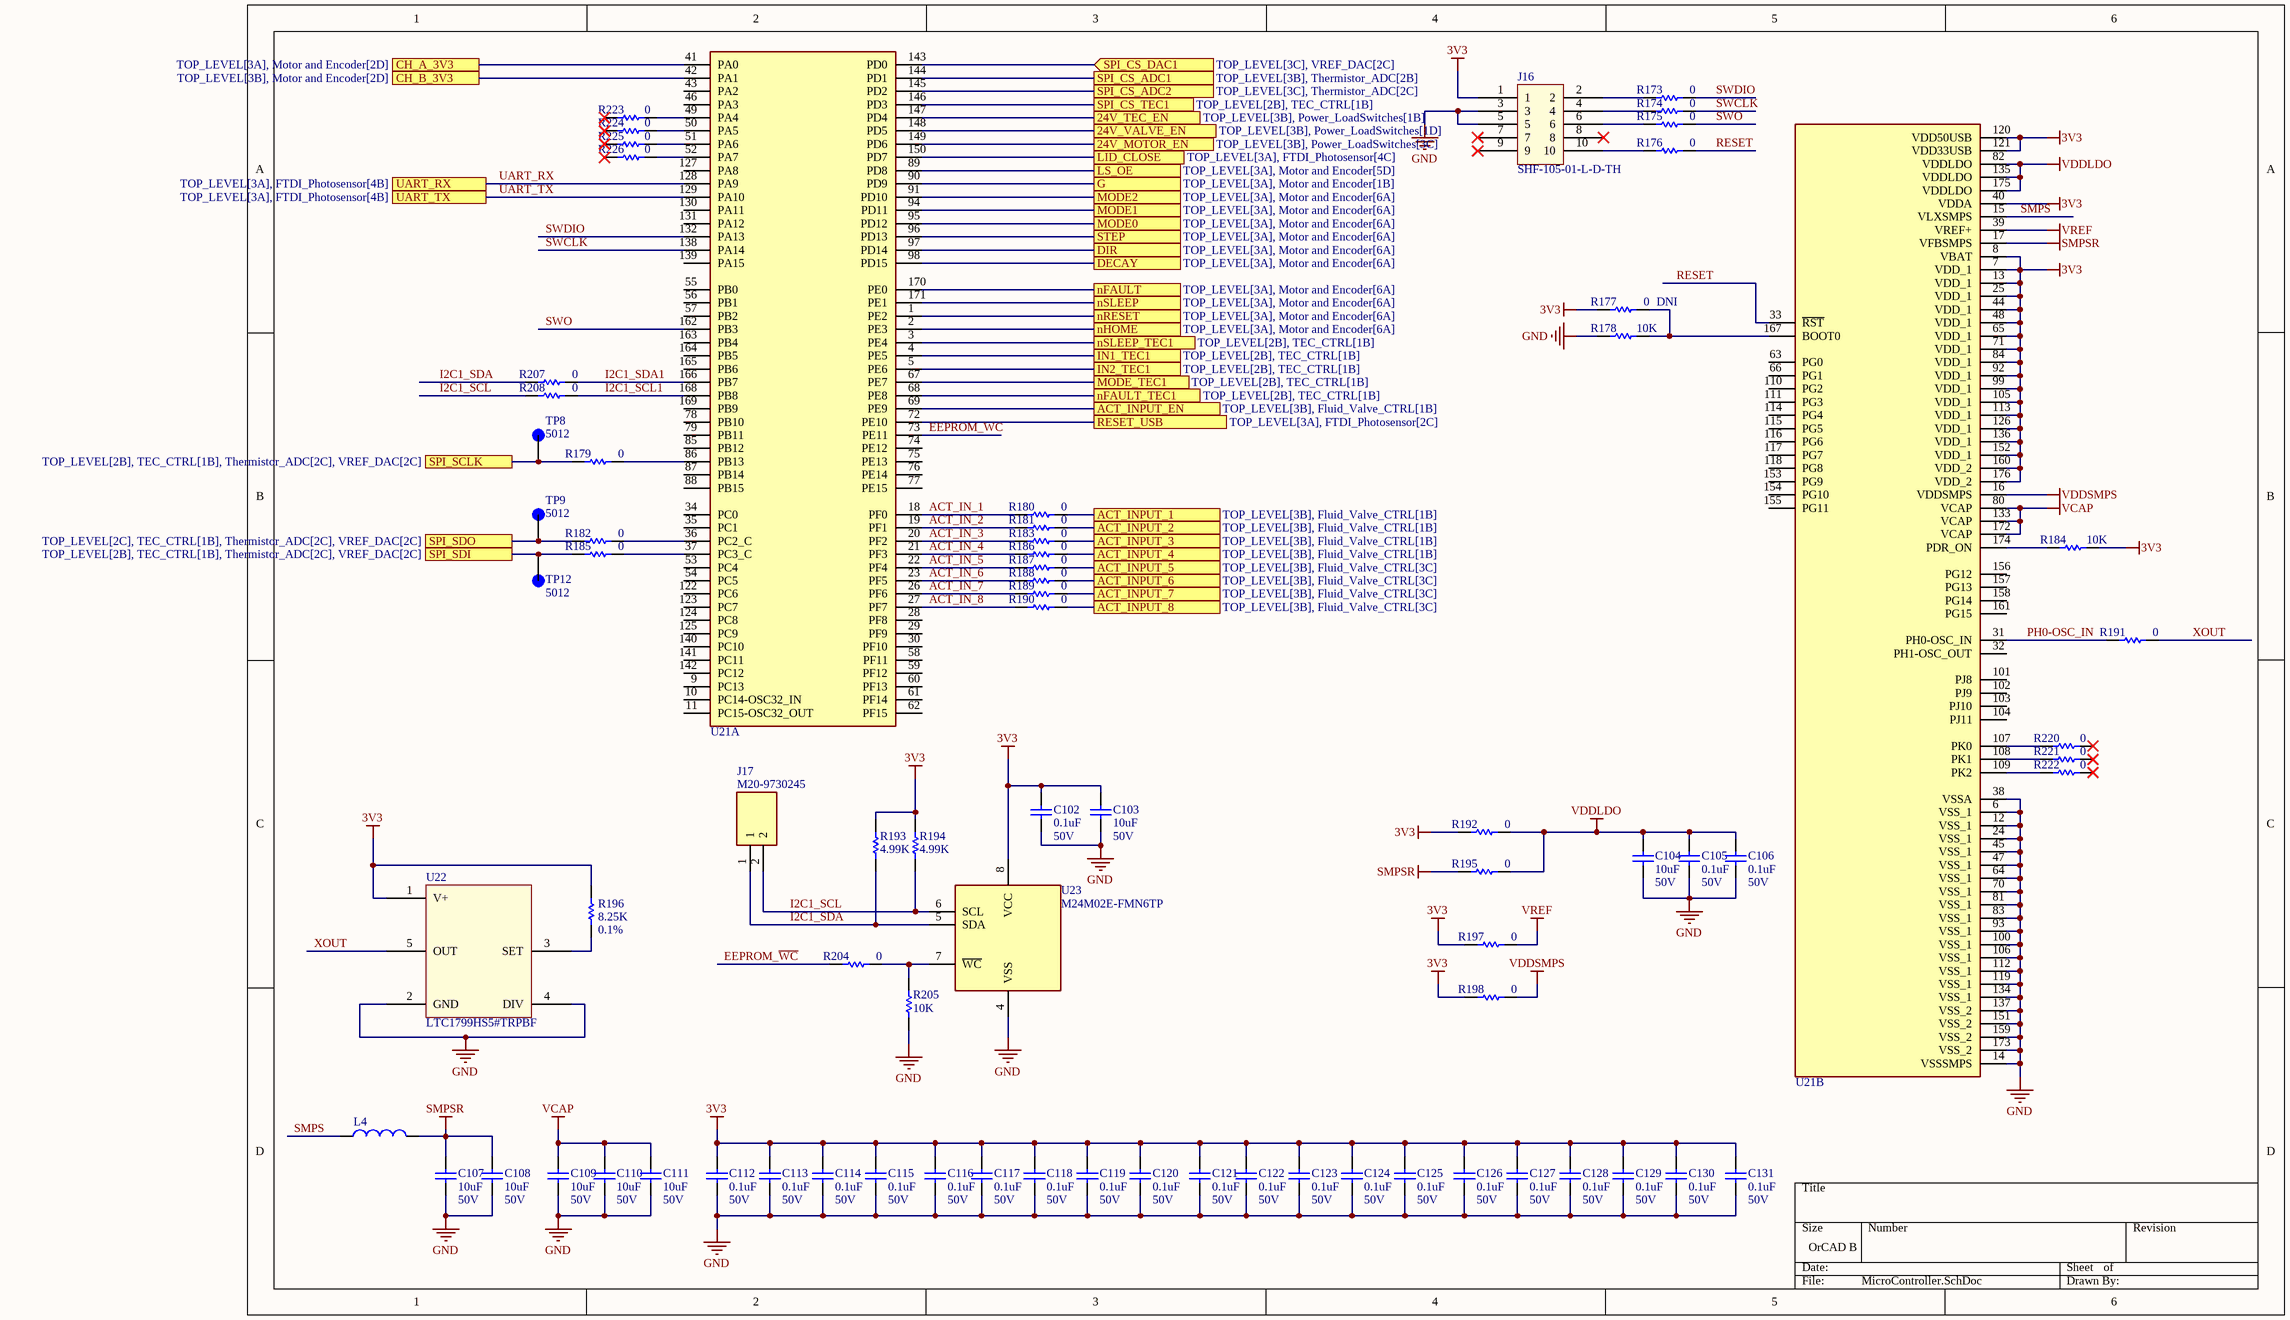
[diagram p9: MicroController.SchDoc]

### Parts
C102  value 0.1uF  Rating: 50V  [DEFAULT_CAPACITOR_0805]  (hidden comment: KGM21NR71H104KT)
C103  value 10uF  Rating: 50V  [DEFAULT_CAPACITOR_0805]  (hidden comment: GRM21BR61H106KE43L)
C104  value 10uF  Rating: 50V  [DEFAULT_CAPACITOR_0805]  (hidden comment: GRM21BR61H106KE43L)
C105  value 0.1uF  Rating: 50V  [DEFAULT_CAPACITOR_0805]  (hidden comment: KGM21NR71H104KT)
C106  value 0.1uF  Rating: 50V  [DEFAULT_CAPACITOR_0805]  (hidden comment: KGM21NR71H104KT)
C107  value 10uF  Rating: 50V  [DEFAULT_CAPACITOR_0805]  (hidden comment: GRM21BR61H106KE43L)
C108  value 10uF  Rating: 50V  [DEFAULT_CAPACITOR_0805]  (hidden comment: GRM21BR61H106KE43L)
C109  value 10uF  Rating: 50V  [DEFAULT_CAPACITOR_0805]  (hidden comment: GRM21BR61H106KE43L)
C110  value 10uF  Rating: 50V  [DEFAULT_CAPACITOR_0805]  (hidden comment: GRM21BR61H106KE43L)
C111  value 10uF  Rating: 50V  [DEFAULT_CAPACITOR_0805]  (hidden comment: GRM21BR61H106KE43L)
C112  value 0.1uF  Rating: 50V  [DEFAULT_CAPACITOR_0805]  (hidden comment: KGM21NR71H104KT)
C113  value 0.1uF  Rating: 50V  [DEFAULT_CAPACITOR_0805]  (hidden comment: KGM21NR71H104KT)
C114  value 0.1uF  Rating: 50V  [DEFAULT_CAPACITOR_0805]  (hidden comment: KGM21NR71H104KT)
C115  value 0.1uF  Rating: 50V  [DEFAULT_CAPACITOR_0805]  (hidden comment: KGM21NR71H104KT)
C116  value 0.1uF  Rating: 50V  [DEFAULT_CAPACITOR_0805]  (hidden comment: KGM21NR71H104KT)
C117  value 0.1uF  Rating: 50V  [DEFAULT_CAPACITOR_0805]  (hidden comment: KGM21NR71H104KT)
C118  value 0.1uF  Rating: 50V  [DEFAULT_CAPACITOR_0805]  (hidden comment: KGM21NR71H104KT)
C119  value 0.1uF  Rating: 50V  [DEFAULT_CAPACITOR_0805]  (hidden comment: KGM21NR71H104KT)
C120  value 0.1uF  Rating: 50V  [DEFAULT_CAPACITOR_0805]  (hidden comment: KGM21NR71H104KT)
C121  value 0.1uF  Rating: 50V  [DEFAULT_CAPACITOR_0805]  (hidden comment: KGM21NR71H104KT)
C122  value 0.1uF  Rating: 50V  [DEFAULT_CAPACITOR_0805]  (hidden comment: KGM21NR71H104KT)
C123  value 0.1uF  Rating: 50V  [DEFAULT_CAPACITOR_0805]  (hidden comment: KGM21NR71H104KT)
C124  value 0.1uF  Rating: 50V  [DEFAULT_CAPACITOR_0805]  (hidden comment: KGM21NR71H104KT)
C125  value 0.1uF  Rating: 50V  [DEFAULT_CAPACITOR_0805]  (hidden comment: KGM21NR71H104KT)
C126  value 0.1uF  Rating: 50V  [DEFAULT_CAPACITOR_0805]  (hidden comment: KGM21NR71H104KT)
C127  value 0.1uF  Rating: 50V  [DEFAULT_CAPACITOR_0805]  (hidden comment: KGM21NR71H104KT)
C128  value 0.1uF  Rating: 50V  [DEFAULT_CAPACITOR_0805]  (hidden comment: KGM21NR71H104KT)
C129  value 0.1uF  Rating: 50V  [DEFAULT_CAPACITOR_0805]  (hidden comment: KGM21NR71H104KT)
C130  value 0.1uF  Rating: 50V  [DEFAULT_CAPACITOR_0805]  (hidden comment: KGM21NR71H104KT)
C131  value 0.1uF  Rating: 50V  [DEFAULT_CAPACITOR_0805]  (hidden comment: KGM21NR71H104KT)
J16  SHF-105-01-L-D-TH  [SAMTEC-SHF-105-01-L-D-TH]
J17  M20-9730245  [M209730245]
L4  LQM2MPN2R2MG0L  [INDC2016X100N]  (value not drawn)
R173  value 0  [DEFAULT_RESISTOR_0805]  (hidden comment: RC0805JR-070RL)
R174  value 0  [DEFAULT_RESISTOR_0805]  (hidden comment: RC0805JR-070RL)
R175  value 0  [DEFAULT_RESISTOR_0805]  (hidden comment: RC0805JR-070RL)
R176  value 0  [DEFAULT_RESISTOR_0805]  (hidden comment: RC0805JR-070RL)
R177  DNI  value 0  [DEFAULT_RESISTOR_0805]
R178  value 10K  [DEFAULT_RESISTOR_0805]  (hidden comment: CRCW080510K0FKEA)
R179  value 0  [DEFAULT_RESISTOR_0805]  (hidden comment: RC0805JR-070RL)
R180  value 0  [DEFAULT_RESISTOR_0805]  (hidden comment: RC0805JR-070RL)
R181  value 0  [DEFAULT_RESISTOR_0805]  (hidden comment: RC0805JR-070RL)
R182  value 0  [DEFAULT_RESISTOR_0805]  (hidden comment: RC0805JR-070RL)
R183  value 0  [DEFAULT_RESISTOR_0805]  (hidden comment: RC0805JR-070RL)
R184  value 10K  [DEFAULT_RESISTOR_0805]  (hidden comment: CRCW080510K0FKEA)
R185  value 0  [DEFAULT_RESISTOR_0805]  (hidden comment: RC0805JR-070RL)
R186  value 0  [DEFAULT_RESISTOR_0805]  (hidden comment: RC0805JR-070RL)
R187  value 0  [DEFAULT_RESISTOR_0805]  (hidden comment: RC0805JR-070RL)
R188  value 0  [DEFAULT_RESISTOR_0805]  (hidden comment: RC0805JR-070RL)
R189  value 0  [DEFAULT_RESISTOR_0805]  (hidden comment: RC0805JR-070RL)
R190  value 0  [DEFAULT_RESISTOR_0805]  (hidden comment: RC0805JR-070RL)
R191  value 0  [DEFAULT_RESISTOR_0805]  (hidden comment: RC0805JR-070RL)
R192  value 0  [DEFAULT_RESISTOR_0805]  (hidden comment: RC0805JR-070RL)
R193  value 4.99K  [DEFAULT_RESISTOR_0805]  (hidden comment: RMCF0805FT4K99)
R194  value 4.99K  [DEFAULT_RESISTOR_0805]  (hidden comment: RMCF0805FT4K99)
R195  value 0  [DEFAULT_RESISTOR_0805]  (hidden comment: RC0805JR-070RL)
R196  value 8.25K  Tolerance: 0.1%  [DEFAULT_RESISTOR_0805]  (hidden comment: ERA-6AEB8251V)
R197  value 0  [DEFAULT_RESISTOR_0805]  (hidden comment: RC0805JR-070RL)
R198  value 0  [DEFAULT_RESISTOR_0805]  (hidden comment: RC0805JR-070RL)
R204  value 0  [DEFAULT_RESISTOR_0805]  (hidden comment: RC0805JR-070RL)
R205  value 10K  [DEFAULT_RESISTOR_0805]  (hidden comment: CRCW080510K0FKEA)
R207  value 0  [DEFAULT_RESISTOR_0805]  (hidden comment: RC0805JR-070RL)
R208  value 0  [DEFAULT_RESISTOR_0805]  (hidden comment: RC0805JR-070RL)
R220  value 0  [DEFAULT_RESISTOR_0805]  (hidden comment: RC0805JR-070RL)
R221  value 0  [DEFAULT_RESISTOR_0805]  (hidden comment: RC0805JR-070RL)
R222  value 0  [DEFAULT_RESISTOR_0805]  (hidden comment: RC0805JR-070RL)
R223  value 0  [DEFAULT_RESISTOR_0805]  (hidden comment: RC0805JR-070RL)
R224  value 0  [DEFAULT_RESISTOR_0805]  (hidden comment: RC0805JR-070RL)
R225  value 0  [DEFAULT_RESISTOR_0805]  (hidden comment: RC0805JR-070RL)
R226  value 0  [DEFAULT_RESISTOR_0805]  (hidden comment: RC0805JR-070RL)
TP8  5012  [TP_5011]
TP9  5012  [TP_5011]
TP12  5012  [TP_5011]
U21  STM32H735IGT6  [STM32H7351GT6-LQFP176]  (value not drawn)  (parts A,B of 2)
U22  LTC1799HS5#TRPBF  [LTC1799HS5-TSOT23-5]
U23  M24M02E-FMN6TP  [8ld - SOIC]

### Ports
24V_MOTOR_EN (see TOP_LEVEL[3B], Power_LoadSwitches[3C]), 24V_TEC_EN (see TOP_LEVEL[3B], Power_LoadSwitches[1B]), 24V_VALVE_EN (see TOP_LEVEL[3B], Power_LoadSwitches[1D]), ACT_INPUT_1 (see TOP_LEVEL[3B], Fluid_Valve_CTRL[1B]), ACT_INPUT_2 (see TOP_LEVEL[3B], Fluid_Valve_CTRL[1B]), ACT_INPUT_3 (see TOP_LEVEL[3B], Fluid_Valve_CTRL[1B]), ACT_INPUT_4 (see TOP_LEVEL[3B], Fluid_Valve_CTRL[1B]), ACT_INPUT_5 (see TOP_LEVEL[3B], Fluid_Valve_CTRL[3C]), ACT_INPUT_6 (see TOP_LEVEL[3B], Fluid_Valve_CTRL[3C]), ACT_INPUT_7 (see TOP_LEVEL[3B], Fluid_Valve_CTRL[3C]), ACT_INPUT_8 (see TOP_LEVEL[3B], Fluid_Valve_CTRL[3C]), ACT_INPUT_EN (see TOP_LEVEL[3B], Fluid_Valve_CTRL[1B]), CH_A_3V3 (see TOP_LEVEL[3A], Motor and Encoder[2D]), CH_B_3V3 (see TOP_LEVEL[3B], Motor and Encoder[2D]), DECAY (see TOP_LEVEL[3A], Motor and Encoder[6A]), DIR (see TOP_LEVEL[3A], Motor and Encoder[6A]), G (see TOP_LEVEL[3A], Motor and Encoder[1B]), IN1_TEC1 (see TOP_LEVEL[2B], TEC_CTRL[1B]), IN2_TEC1 (see TOP_LEVEL[2B], TEC_CTRL[1B]), LID_CLOSE (see TOP_LEVEL[3A], FTDI_Photosensor[4C]), LS_OE (see TOP_LEVEL[3A], Motor and Encoder[5D]), MODE0 (see TOP_LEVEL[3A], Motor and Encoder[6A]), MODE1 (see TOP_LEVEL[3A], Motor and Encoder[6A]), MODE2 (see TOP_LEVEL[3A], Motor and Encoder[6A]), MODE_TEC1 (see TOP_LEVEL[2B], TEC_CTRL[1B]), nFAULT (see TOP_LEVEL[3A], Motor and Encoder[6A]), nFAULT_TEC1 (see TOP_LEVEL[2B], TEC_CTRL[1B]), nHOME (see TOP_LEVEL[3A], Motor and Encoder[6A]), nRESET (see TOP_LEVEL[3A], Motor and Encoder[6A]), nSLEEP (see TOP_LEVEL[3A], Motor and Encoder[6A]), nSLEEP_TEC1 (see TOP_LEVEL[2B], TEC_CTRL[1B]), RESET_USB (see TOP_LEVEL[3A], FTDI_Photosensor[2C]), SPI_CS_ADC1 (see TOP_LEVEL[3B], Thermistor_ADC[2B]), SPI_CS_ADC2 (see TOP_LEVEL[3C], Thermistor_ADC[2C]), SPI_CS_DAC1 (in, see TOP_LEVEL[3C], VREF_DAC[2C]), SPI_CS_TEC1 (see TOP_LEVEL[2B], TEC_CTRL[1B]), SPI_SCLK (see TOP_LEVEL[2B], TEC_CTRL[1B], Thermistor_ADC[2C], VREF_DAC[2C]), SPI_SDI (see TOP_LEVEL[2B], TEC_CTRL[1B], Thermistor_ADC[2C], VREF_DAC[2C]), SPI_SDO (see TOP_LEVEL[2C], TEC_CTRL[1B], Thermistor_ADC[2C], VREF_DAC[2C]), STEP (see TOP_LEVEL[3A], Motor and Encoder[6A]), UART_RX (see TOP_LEVEL[3A], FTDI_Photosensor[4B]), UART_TX (see TOP_LEVEL[3A], FTDI_Photosensor[4B])

### Nets
3V3: C102.2 C103.2 C112.2 C113.2 C114.2 C115.2 C116.2 C117.2 C118.2 C119.2 C120.2 C121.2 C122.2 C123.2 C124.2 C125.2 C126.2 C127.2 C128.2 C129.2 C130.2 C131.2 J16.1 R177.2 R184.1 R192.2 R193.1 R194.1 R196.1 R197.2 R198.2 U21.7(VDD_1) U21.8(VBAT) U21.13(VDD_1) U21.25(VDD_1) U21.40(VDDA) U21.44(VDD_1) U21.48(VDD_1) U21.65(VDD_1) U21.71(VDD_1) U21.84(VDD_1) U21.92(VDD_1) U21.99(VDD_1) U21.105(VDD_1) U21.113(VDD_1) U21.120(VDD50USB) U21.121(VDD33USB) U21.126(VDD_1) U21.136(VDD_1) U21.152(VDD_1) U21.160(VDD_2) U21.176(VDD_2) U22.1(V+) U23.8(VCC)
GND: C102.1 C103.1 C104.1 C105.1 C106.1 C107.1 C108.1 C109.1 C110.1 C111.1 C112.1 C113.1 C114.1 C115.1 C116.1 C117.1 C118.1 C119.1 C120.1 C121.1 C122.1 C123.1 C124.1 C125.1 C126.1 C127.1 C128.1 C129.1 C130.1 C131.1 J16.3 J16.5 R178.2 R205.2 U21.6(VSS_1) U21.12(VSS_1) U21.14(VSSSMPS) U21.24(VSS_1) U21.38(VSSA) U21.45(VSS_1) U21.47(VSS_1) U21.64(VSS_1) U21.70(VSS_1) U21.81(VSS_1) U21.83(VSS_1) U21.93(VSS_1) U21.100(VSS_1) U21.106(VSS_1) U21.112(VSS_1) U21.119(VSS_1) U21.134(VSS_1) U21.137(VSS_2) U21.151(VSS_2) U21.159(VSS_2) U21.173(VSS_2) U22.2(GND) U22.4(DIV) U23.4(VSS)
SMPSR: C107.2 C108.2 L4.2 R195.2 U21.17(VFBSMPS)
VCAP: C109.2 C110.2 C111.2 U21.80(VCAP) U21.133(VCAP) U21.172(VCAP)
VDDLDO: C104.2 C105.2 C106.2 R192.1 R195.1 U21.82(VDDLDO) U21.135(VDDLDO) U21.175(VDDLDO)
VDDSMPS: R198.1 U21.16(VDDSMPS)
VREF: R197.1 U21.39(VREF+)
24V_MOTOR_EN: U21.149(PD6) ; port 24V_MOTOR_EN
24V_TEC_EN: U21.147(PD4) ; port 24V_TEC_EN
24V_VALVE_EN: U21.148(PD5) ; port 24V_VALVE_EN
ACT_IN_1: R180.2 U21.18(PF0)
ACT_IN_2: R181.2 U21.19(PF1)
ACT_IN_3: R183.2 U21.20(PF2)
ACT_IN_4: R186.2 U21.21(PF3)
ACT_IN_5: R187.2 U21.22(PF4)
ACT_IN_6: R188.2 U21.23(PF5)
ACT_IN_7: R189.2 U21.26(PF6)
ACT_IN_8: R190.2 U21.27(PF7)
ACT_INPUT_1: R180.1 ; port ACT_INPUT_1
ACT_INPUT_2: R181.1 ; port ACT_INPUT_2
ACT_INPUT_3: R183.1 ; port ACT_INPUT_3
ACT_INPUT_4: R186.1 ; port ACT_INPUT_4
ACT_INPUT_5: R187.1 ; port ACT_INPUT_5
ACT_INPUT_6: R188.1 ; port ACT_INPUT_6
ACT_INPUT_7: R189.1 ; port ACT_INPUT_7
ACT_INPUT_8: R190.1 ; port ACT_INPUT_8
ACT_INPUT_EN: U21.69(PE9) ; port ACT_INPUT_EN
CH_A_3V3: U21.41(PA0) ; port CH_A_3V3
CH_B_3V3: U21.42(PA1) ; port CH_B_3V3
DECAY: U21.98(PD15) ; port DECAY
DIR: U21.97(PD14) ; port DIR
EEPROM_~{WC}: R204.2 U21.73(PE11)
G: U21.90(PD9) ; port G
I2C1_SCL: J17.2 R194.2 R208.2 U23.6(SCL)
I2C1_SCL1: R208.1 U21.168(PB8)
I2C1_SDA: J17.1 R193.2 R207.2 U23.5(SDA)
I2C1_SDA1: R207.1 U21.166(PB7)
IN1_TEC1: U21.4(PE5) ; port IN1_TEC1
IN2_TEC1: U21.5(PE6) ; port IN2_TEC1
LID_CLOSE: U21.150(PD7) ; port LID_CLOSE
LS_OE: U21.89(PD8) ; port LS_OE
MODE0: U21.95(PD12) ; port MODE0
MODE1: U21.94(PD11) ; port MODE1
MODE2: U21.91(PD10) ; port MODE2
MODE_TEC1: U21.67(PE7) ; port MODE_TEC1
nFAULT: U21.170(PE0) ; port nFAULT
nFAULT_TEC1: U21.68(PE8) ; port nFAULT_TEC1
nHOME: U21.2(PE3) ; port nHOME
nRESET: U21.1(PE2) ; port nRESET
nSLEEP: U21.171(PE1) ; port nSLEEP
nSLEEP_TEC1: U21.3(PE4) ; port nSLEEP_TEC1
PH0-OSC_IN: R191.2 U21.31(PH0-OSC_IN)
RESET: R176.1 U21.33(~{RST})
RESET_USB: U21.72(PE10) ; port RESET_USB
SMPS: L4.1 U21.15(VLXSMPS)
SPI_CS_ADC1: U21.144(PD1) ; port SPI_CS_ADC1
SPI_CS_ADC2: U21.145(PD2) ; port SPI_CS_ADC2
SPI_CS_DAC1: U21.143(PD0) ; port SPI_CS_DAC1
SPI_CS_TEC1: U21.146(PD3) ; port SPI_CS_TEC1
SPI_SCLK: R179.2 TP8.TP ; port SPI_SCLK
SPI_SDI: R185.2 TP12.TP ; port SPI_SDI
SPI_SDO: R182.2 TP9.TP ; port SPI_SDO
STEP: U21.96(PD13) ; port STEP
SWCLK: R174.1 U21.138(PA14)
SWDIO: R173.1 U21.132(PA13)
SWO: R175.1 U21.162(PB3)
UART_RX: U21.128(PA9) ; port UART_RX
UART_TX: U21.129(PA10) ; port UART_TX
XOUT: R191.1 U22.5(OUT)
NetJ16_2: J16.2 R173.2
NetJ16_4: J16.4 R174.2
NetJ16_6: J16.6 R175.2
NetJ16_10: J16.10 R176.2
NetR177_1: R177.1 R178.1 U21.167(BOOT0)
NetR179_1: R179.1 U21.86(PB13)
NetR182_1: R182.1 U21.36(PC2_C)
NetR184_2: R184.2 U21.174(PDR_ON)
NetR185_1: R185.1 U21.37(PC3_C)
NetR196_2: R196.2 U22.3(SET)
NetR204_1: R204.1 R205.1 U23.7(~{WC})
NetR220_2: R220.2 U21.107(PK0)
NetR221_2: R221.2 U21.108(PK1)
NetR222_2: R222.2 U21.109(PK2)
NetR223_1: R223.1 U21.49(PA4)
NetR224_1: R224.1 U21.50(PA5)
NetR225_1: R225.1 U21.51(PA6)
NetR226_1: R226.1 U21.52(PA7)

Not connected (* = marked no-connect by the designer): J16 7* 8* 9*; R220 1*; R221 1*; R222 1*; R223 2*; R224 2*; R225 2*; R226 2*; U21 9(PC13) 10(PC14-OSC32_IN) 11(PC15-OSC32_OUT) 28(PF8) 29(PF9) 30(PF10) 32(PH1-OSC_OUT) 34(PC0) 35(PC1) 43(PA2) 46(PA3) 53(PC4) 54(PC5) 55(PB0) 56(PB1) 57(PB2) 58(PF11) 59(PF12) 60(PF13) 61(PF14) 62(PF15) 63(PG0) 66(PG1) 74(PE12) 75(PE13) 76(PE14) 77(PE15) 78(PB10) 79(PB11) 85(PB12) 87(PB14) 88(PB15) 101(PJ8) 102(PJ9) 103(PJ10) 104(PJ11) 110(PG2) 111(PG3) 114(PG4) 115(PG5) 116(PG6) 117(PG7) 118(PG8) 122(PC6) 123(PC7) 124(PC8) 125(PC9) 127(PA8) 130(PA11) 131(PA12) 139(PA15) 140(PC10) 141(PC11) 142(PC12) 153(PG9) 154(PG10) 155(PG11) 156(PG12) 157(PG13) 158(PG14) 161(PG15) 163(PB4) 164(PB5) 165(PB6) 169(PB9); U23 1(NC) 2(NC) 3(NC)

### Library data of the parts
C102 C105 C106 C112-C131 = KGM21NR71H104KT: as C86 on sheet VREF_DAC; MFR PN: KGM21NR71H104KT
C103 C104 C107-C111 = GRM21BR61H106KE43L: CAP CER 10UF 50V X5R 0805; MFR PN: GRM21BR61H106KE43L
J16 = SHF-105-01-L-D-TH: CONN HEADER VERT 10POS 1.27MM; Manufacturer: Sametc; MFR PN: SHF-105-01-L-D-TH; Manufacturer P/N: SHF-105-01-L-D-TH
J17 = M20-9730245: as J15 on sheet FTDI_Photosensor; Manufacturer_Part_Number: M20-9730245; Mouser Part Number: 855-M20-9730245; Mouser Price/Stock: https://www.mouser.co.uk/ProductDetail/Harwin/M20-9730245?qs=%252Bk6%2F5FB6qrkOd7%252Bh6nj7DA%3D%3D; Arrow Part Number: *; Arrow Price/Stock: *; Datasheet Link: https://content.harwin.com/m/d105a7681d963845/original/DRG-00452-Technical-Drawing-Datasheet-M20-973-pdf.pdf; MFR PN: M20-9730245
L4 = LQM2MPN2R2MG0L: Inductor with Inductance: 2.2uH Tol. +/-20%, Package: 0806 (2016); Value: 2.2uH; MFR PN: LQM2MPN2R2MG0L
R173-R177 R179-R183 R185-R192 R195 R197 R198 R204 R207 R208 R220-R226 = RC0805JR-070RL: RES 0 OHM JUMPER 1/8W 0805; Power: 1/8W; MFR PN: RC0805JR-070RL; Tolerance: *
R178 R184 R205 = CRCW080510K0FKEA: RES SMD 10K OHM 1% 1/4W 0805; Power: 1/4W; MFR PN: CRCW080510K0FKEA; Tolerance: 1%
R193 R194 = RMCF0805FT4K99: RES 4.99K OHM 1% 1/8W 0805; Power: 1/8W; MFR PN: RMCF0805FT4K99; Tolerance: 1%
R196 = ERA-6AEB8251V: RES SMD 8.25K OHM 0.1% 1/8W 0805; Power: 1/8W; MFR PN: ERA-6AEB8251V
TP8 TP9 TP12 = 5012: PC TEST POINT MULTIPURPOSE WHITE; MFR PN: 5012
U21 = STM32H735IGT6: ARM® Cortex®-M7 STM32H7 Microcontroller IC 32-Bit 550MHz 1MB (1M x 8) FLASH 176-LQFP (24x24); Manufacturer: STMicroelectronics; Manufacturer P/N: STM32H735IGT6; MFR PN: STM32H735IGT6
U22 = LTC1799HS5#TRPBF: IC OSC SILICON PROG TSOT23-5; Manufacturer: Analog Devices; MFR PN: LTC1799HS5#TRPBF; Manufacturer P/N: LTC1799HS5#TRPBF
U23 = M24M02E-FMN6TP: EEPROM Memory IC 2Mbit I2C 1 MHz 450 ns 8-SO; Designer: OMIGA; MP: M24M02E-FMN; MFR PN: M24M02E-FMN6TP

## Sheet Connectors.SchDoc
size Tabloid; SheetNumber: 2; SheetTotal: 11
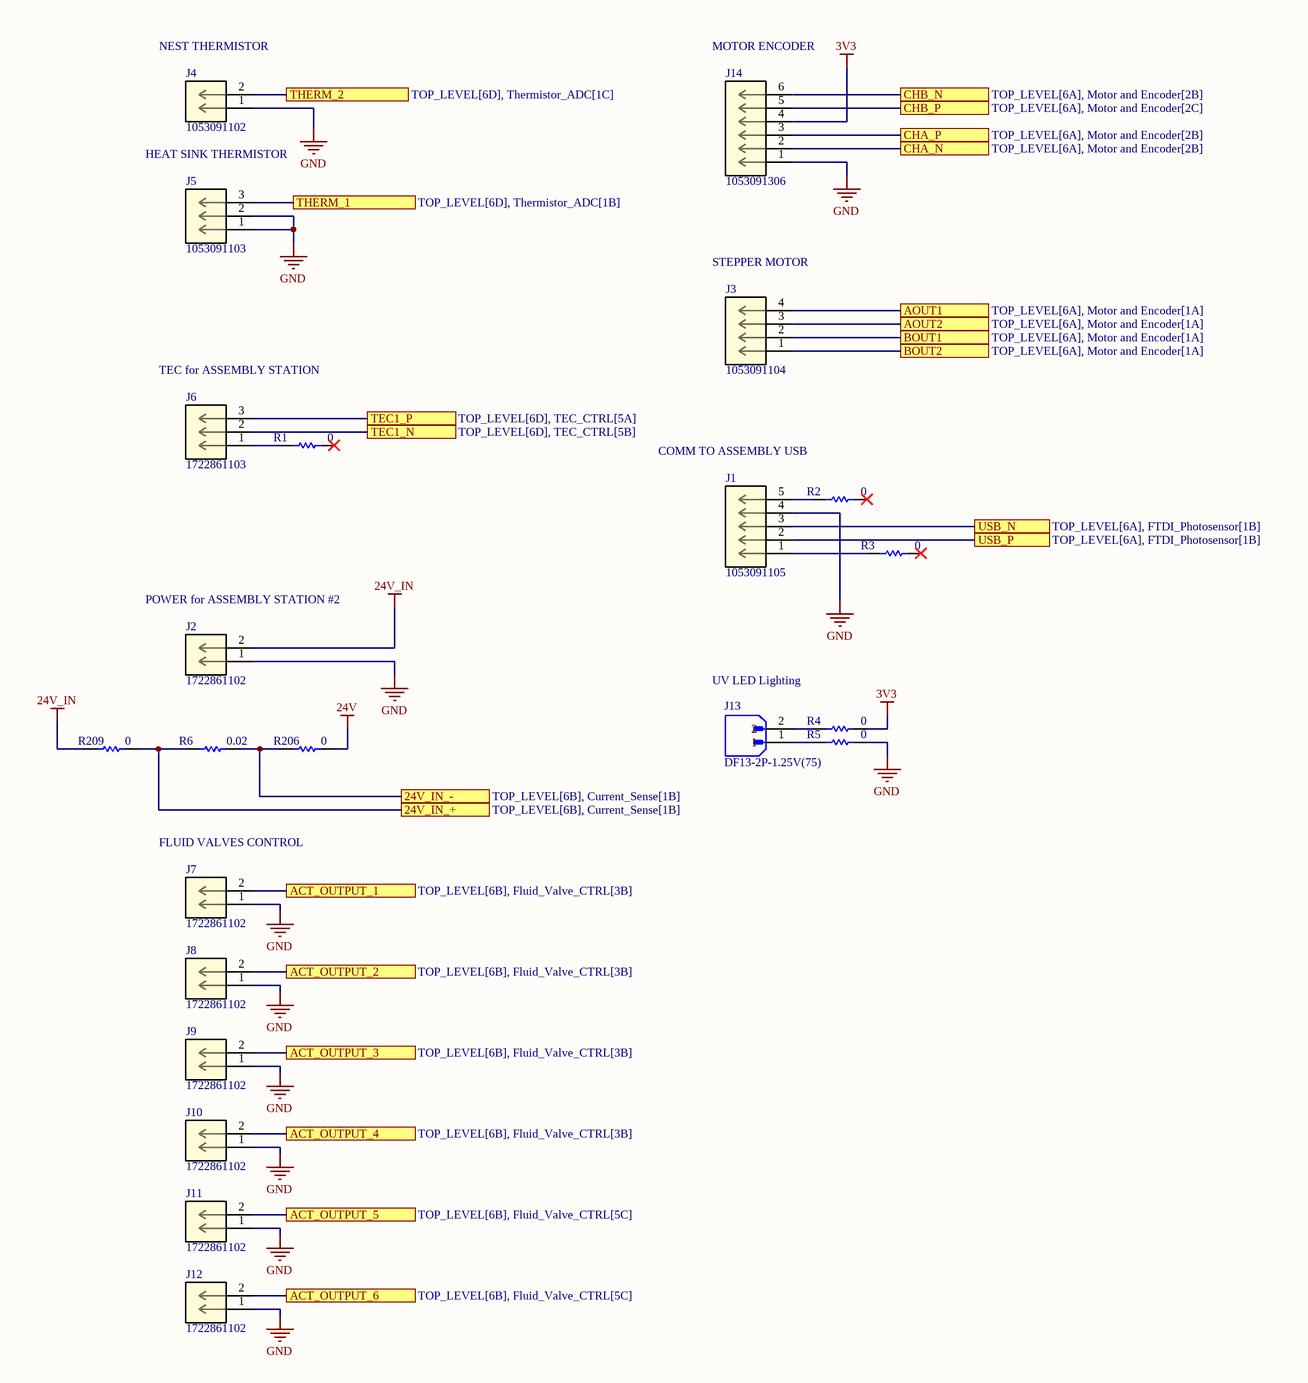
[diagram p10: Connectors.SchDoc]

### Parts
J1  1053091105  [1053091105]
J2  1722861102  [1722861102]
J3  1053091104  [1053091104]
J4  1053091102  [1053091102]
J5  1053091103  [1053091103]
J6  1722861103  [1722861103]
J7  1722861102  [1722861102]
J8  1722861102  [1722861102]
J9  1722861102  [1722861102]
J10  1722861102  [1722861102]
J11  1722861102  [1722861102]
J12  1722861102  [1722861102]
J13  DF13-2P-1.25V(75)  [DF13-2P-1.25V(75)]
J14  1053091306  [1053091306]
R1  value 0  [DEFAULT_RESISTOR_0805]  (hidden comment: RC0805JR-070RL)
R2  value 0  [DEFAULT_RESISTOR_0805]  (hidden comment: RC0805JR-070RL)
R3  value 0  [DEFAULT_RESISTOR_0805]  (hidden comment: RC0805JR-070RL)
R4  value 0  [DEFAULT_RESISTOR_0805]  (hidden comment: RC0805JR-070RL)
R5  value 0  [DEFAULT_RESISTOR_0805]  (hidden comment: RC0805JR-070RL)
R6  value 0.02  [DEFAULT_RESISTOR_0805]  (hidden comment: ERJ-6CWDR020V)
R206  value 0  [DEFAULT_RESISTOR_0805]  (hidden comment: RC0805JR-070RL)
R209  value 0  [DEFAULT_RESISTOR_0805]  (hidden comment: RC0805JR-070RL)

### Ports
24V_IN_+ (see TOP_LEVEL[6B], Current_Sense[1B]), 24V_IN_- (see TOP_LEVEL[6B], Current_Sense[1B]), ACT_OUTPUT_1 (see TOP_LEVEL[6B], Fluid_Valve_CTRL[3B]), ACT_OUTPUT_2 (see TOP_LEVEL[6B], Fluid_Valve_CTRL[3B]), ACT_OUTPUT_3 (see TOP_LEVEL[6B], Fluid_Valve_CTRL[3B]), ACT_OUTPUT_4 (see TOP_LEVEL[6B], Fluid_Valve_CTRL[3B]), ACT_OUTPUT_5 (see TOP_LEVEL[6B], Fluid_Valve_CTRL[5C]), ACT_OUTPUT_6 (see TOP_LEVEL[6B], Fluid_Valve_CTRL[5C]), AOUT1 (see TOP_LEVEL[6A], Motor and Encoder[1A]), AOUT2 (see TOP_LEVEL[6A], Motor and Encoder[1A]), BOUT1 (see TOP_LEVEL[6A], Motor and Encoder[1A]), BOUT2 (see TOP_LEVEL[6A], Motor and Encoder[1A]), CHA_N (see TOP_LEVEL[6A], Motor and Encoder[2B]), CHA_P (see TOP_LEVEL[6A], Motor and Encoder[2B]), CHB_N (see TOP_LEVEL[6A], Motor and Encoder[2B]), CHB_P (see TOP_LEVEL[6A], Motor and Encoder[2C]), TEC1_N (see TOP_LEVEL[6D], TEC_CTRL[5B]), TEC1_P (see TOP_LEVEL[6D], TEC_CTRL[5A]), THERM_1 (see TOP_LEVEL[6D], Thermistor_ADC[1B]), THERM_2 (see TOP_LEVEL[6D], Thermistor_ADC[1C]), USB_N (see TOP_LEVEL[6A], FTDI_Photosensor[1B]), USB_P (see TOP_LEVEL[6A], FTDI_Photosensor[1B])

### Nets
3V3: J14.4 R4.1
24V: R206.1
24V_IN: J2.2 R209.2
GND: J1.4 J2.1 J4.1 J5.1 J5.2 J7.1 J8.1 J9.1 J10.1 J11.1 J12.1 J14.1 R5.1
24V_IN_+: R6.2 R209.1 ; port 24V_IN_+
24V_IN_-: R6.1 R206.2 ; port 24V_IN_-
ACT_OUTPUT_1: J7.2 ; port ACT_OUTPUT_1
ACT_OUTPUT_2: J8.2 ; port ACT_OUTPUT_2
ACT_OUTPUT_3: J9.2 ; port ACT_OUTPUT_3
ACT_OUTPUT_4: J10.2 ; port ACT_OUTPUT_4
ACT_OUTPUT_5: J11.2 ; port ACT_OUTPUT_5
ACT_OUTPUT_6: J12.2 ; port ACT_OUTPUT_6
AOUT1: J3.4 ; port AOUT1
AOUT2: J3.3 ; port AOUT2
BOUT1: J3.2 ; port BOUT1
BOUT2: J3.1 ; port BOUT2
CHA_N: J14.2 ; port CHA_N
CHA_P: J14.3 ; port CHA_P
CHB_N: J14.6 ; port CHB_N
CHB_P: J14.5 ; port CHB_P
TEC1_N: J6.2 ; port TEC1_N
TEC1_P: J6.3 ; port TEC1_P
THERM_1: J5.3 ; port THERM_1
THERM_2: J4.2 ; port THERM_2
USB_N: J1.3 ; port USB_N
USB_P: J1.2 ; port USB_P
NetJ1_1: J1.1 R3.2
NetJ1_5: J1.5 R2.2
NetJ6_1: J6.1 R1.2
NetJ13_1: J13.1 R5.2
NetJ13_2: J13.2 R4.2

Not connected (* = marked no-connect by the designer): R1 1*; R2 1*; R3 1*

### Notes on the sheet
- (near J4) NEST THERMISTOR
- (near J14) MOTOR ENCODER
- HEAT SINK THERMISTOR
- (near J3) STEPPER MOTOR
- (near J6) TEC for ASSEMBLY STATION
- COMM TO ASSEMBLY USB
- (near J2) POWER for ASSEMBLY STATION #2
- UV LED Lighting
- (near J7) FLUID VALVES CONTROL

### Library data of the parts
J1 = 1053091105: Nano-Fit Vertical Header, Through Hole, 2.50mm Pitch, Single Row, 5 Circuits, with Kinked Pins, Tin (Sn) Plating, Black, Glow-Wire Capable, Tray; Manufacturer_Name: Molex Connector Corporation; Copyright: Copyright (C) 2025 Ultra Librarian. All rights reserved.; Manufacturer_Part_Number: 1053091105; RefDes: RefDes; Type: Type; MFR PN: 1053091105
J2 J7-J12 = 1722861102: Ultra-Fit Vertical Header, 3.50mm Pitch, Single Row, 2 Circuits, with Kinked Pins, Tin (Sn), Glow-Wire Capable, Black; Manufacturer_Name: Molex Connector Corporation; Copyright: Copyright (C) 2025 Ultra Librarian. All rights reserved.; Manufacturer_Part_Number: 1722861102; RefDes: RefDes; Type: Type; MFR PN: 1722861102
J3 = 1053091104: Nano-Fit Vertical Header, Through Hole, 2.50mm Pitch, Single Row, 4 Circuits, with Kinked Pins, Tin (Sn) Plating, Black, Glow-Wire Capable, Tray; Manufacturer_Name: Molex Connector Corporation; Copyright: Copyright (C) 2025 Ultra Librarian. All rights reserved.; Manufacturer_Part_Number: 1053091104; RefDes: RefDes; Type: Type; MFR PN: 1053091104
J4 = 1053091102: Nano-Fit Vertical Header, Through Hole, 2.50mm Pitch, Single Row, 2 Circuits, with Kinked Pins, Tin (Sn) Plating, Black, Glow-Wire Capable, Tray; Manufacturer_Name: Molex Connector Corporation; Copyright: Copyright (C) 2025 Ultra Librarian. All rights reserved.; Manufacturer_Part_Number: 1053091102; RefDes: RefDes; Type: Type; MFR PN: 1053091102
J5 = 1053091103: Nano-Fit Vertical Header, Through Hole, 2.50mm Pitch, Single Row, 3 Circuits, with Kinked Pins, Tin (Sn) Plating, Black, Glow-Wire Capable, Tray; Manufacturer_Name: Molex Connector Corporation; Copyright: Copyright (C) 2025 Ultra Librarian. All rights reserved.; Manufacturer_Part_Number: 1053091103; RefDes: RefDes; Type: Type; MFR PN: 1053091103
J6 = 1722861103: Ultra-Fit Vertical Header, 3.50mm Pitch, Single Row, 3 Circuits, with Kinked Pins, Tin (Sn), Glow-Wire Capable, Black; Manufacturer_Name: Molex Connector Corporation; Copyright: Copyright (C) 2025 Ultra Librarian. All rights reserved.; Manufacturer_Part_Number: 1722861103; RefDes: RefDes; Type: Type; MFR PN: 1722861103
J13 = DF13-2P-1.25V(75): Connector Header Surface Mount 2 position 0.049 (1.25mm); MF: Hirose Electric Co Ltd; SnapEDA_Link: https://www.snapeda.com/parts/DF13-2P-1.25V(75)/Hirose+Electric+Co+Ltd/view-part/?ref=snap; Package: None; Value: *; MP: DF13-2P-1.25V(75); Check_prices: https://www.snapeda.com/parts/DF13-2P-1.25V(75)/Hirose+Electric+Co+Ltd/view-part/?ref=eda; MFR PN: DF13-2P-1.25V(75)
J14 = 1053091306: Nano-Fit Vertical Header, Through Hole, 2.50mm Pitch, Single Row, 6 Circuits, with Kinked Pins, 0.76Âµm Gold (Au) Plating, Black, Glow-Wire Capable, Tray; Manufacturer_Name: Molex Connector Corporation; Copyright: Copyright (C) 2025 Ultra Librarian. All rights reserved.; Manufacturer_Part_Number: 1053091306; RefDes: RefDes; Type: Type; MFR PN: 1053091306
R1-R5 R206 R209 = RC0805JR-070RL: RES 0 OHM JUMPER 1/8W 0805; Power: 1/8W; MFR PN: RC0805JR-070RL; Tolerance: *
R6 = ERJ-6CWDR020V: RES 0.02 OHM 0.5% 1/2W 0805; Power: 1/2W; MFR PN: ERJ-6CWDR020V; Tolerance: 0.5%; Parameter 1: *